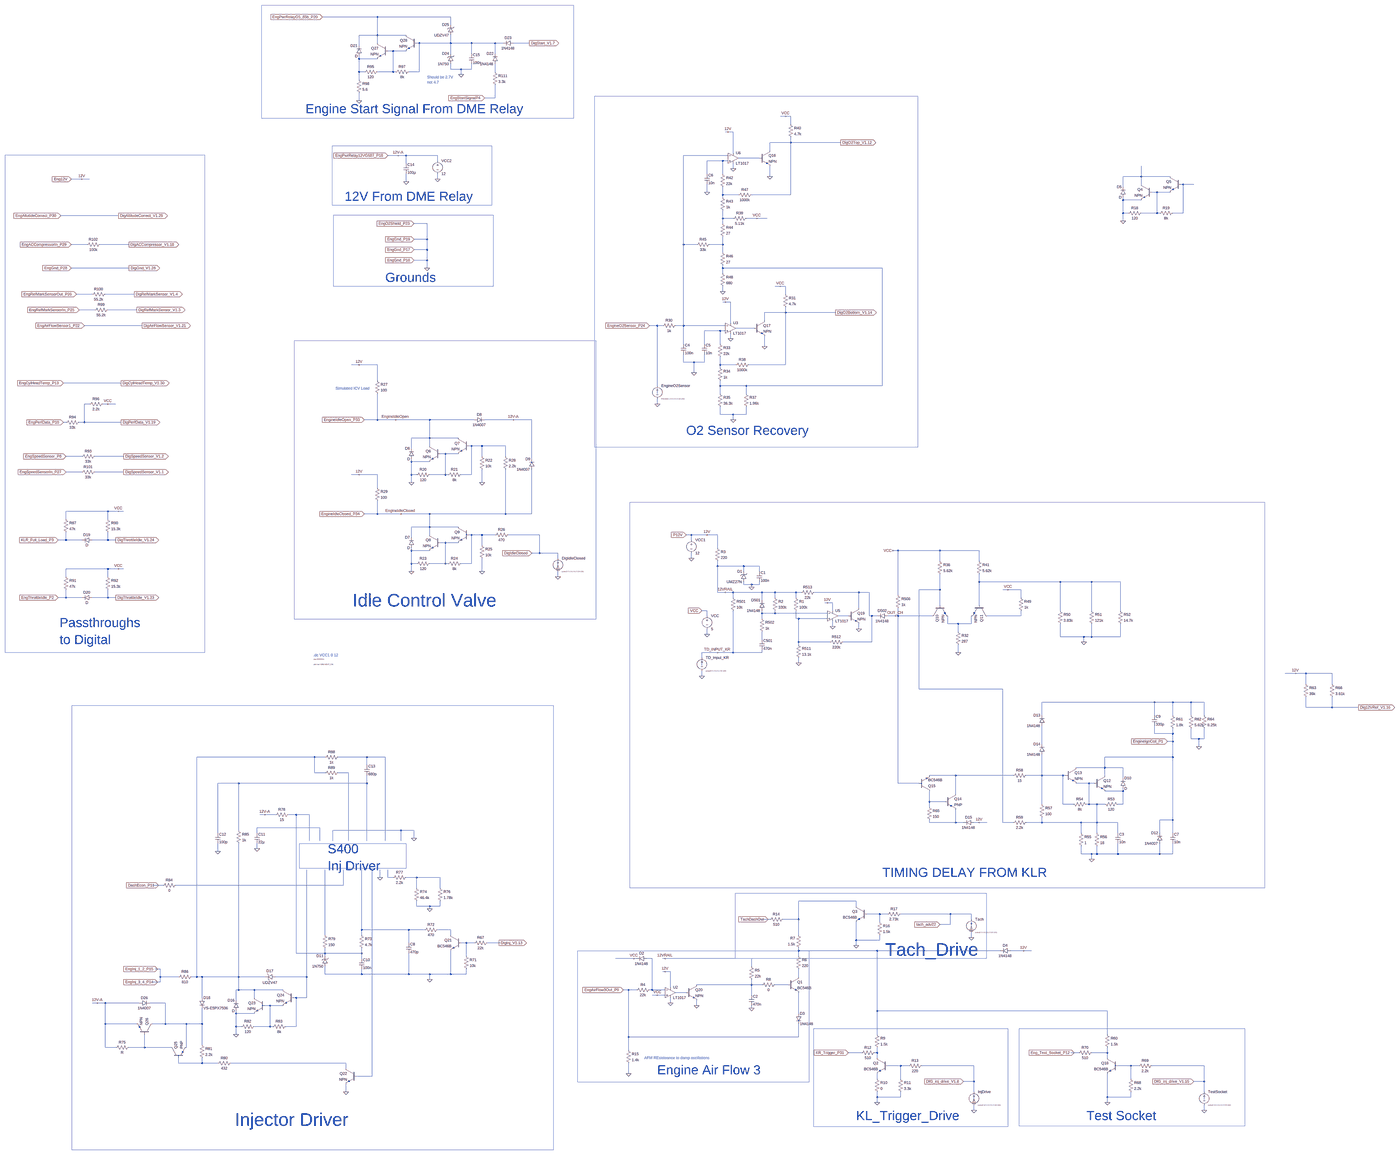
[diagram p0: schematic dme_analog_full_flat.asc, whole sheet]
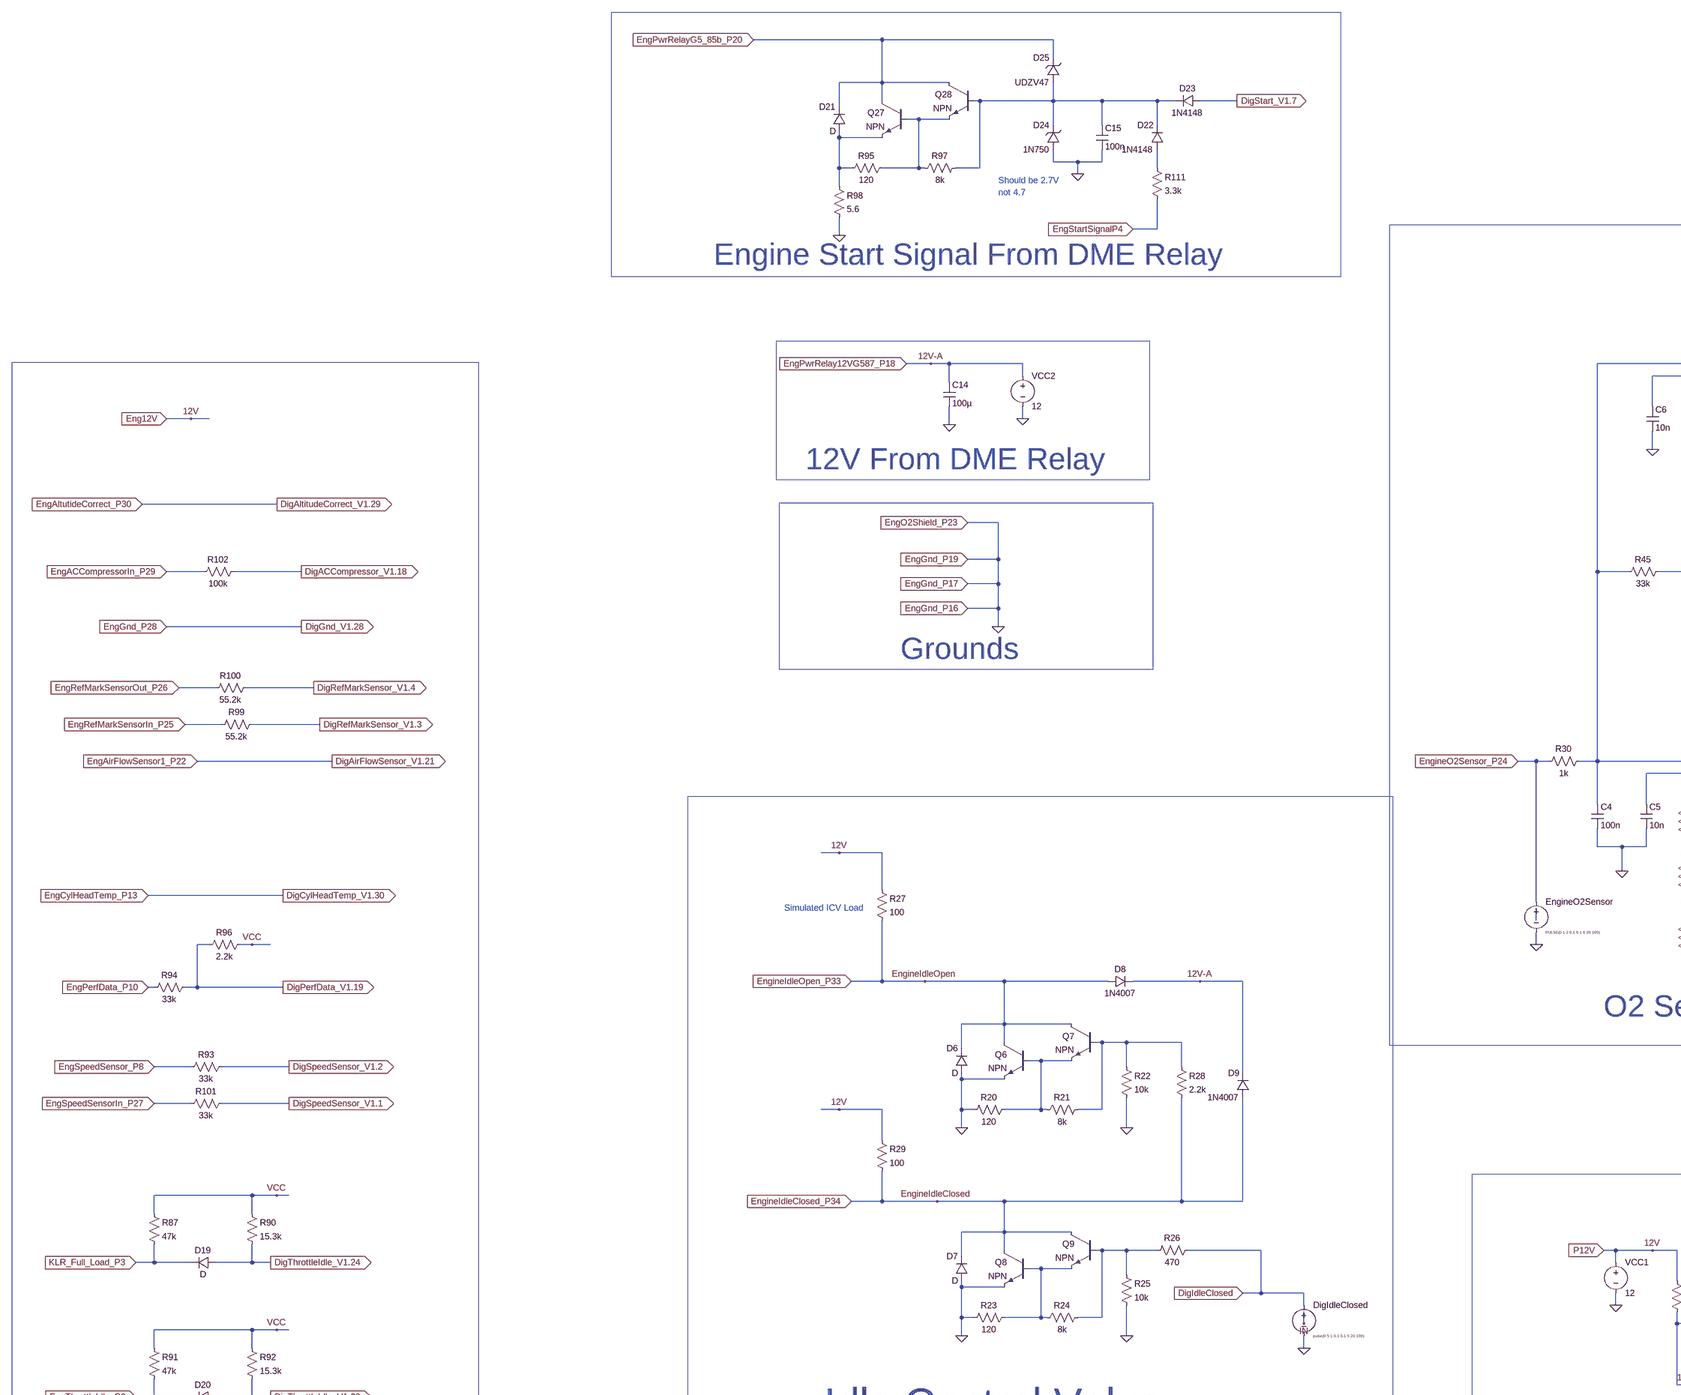
[diagram p1: schematic dme_analog_full_flat.asc, part, row 1 of 2, column 1 of 2]
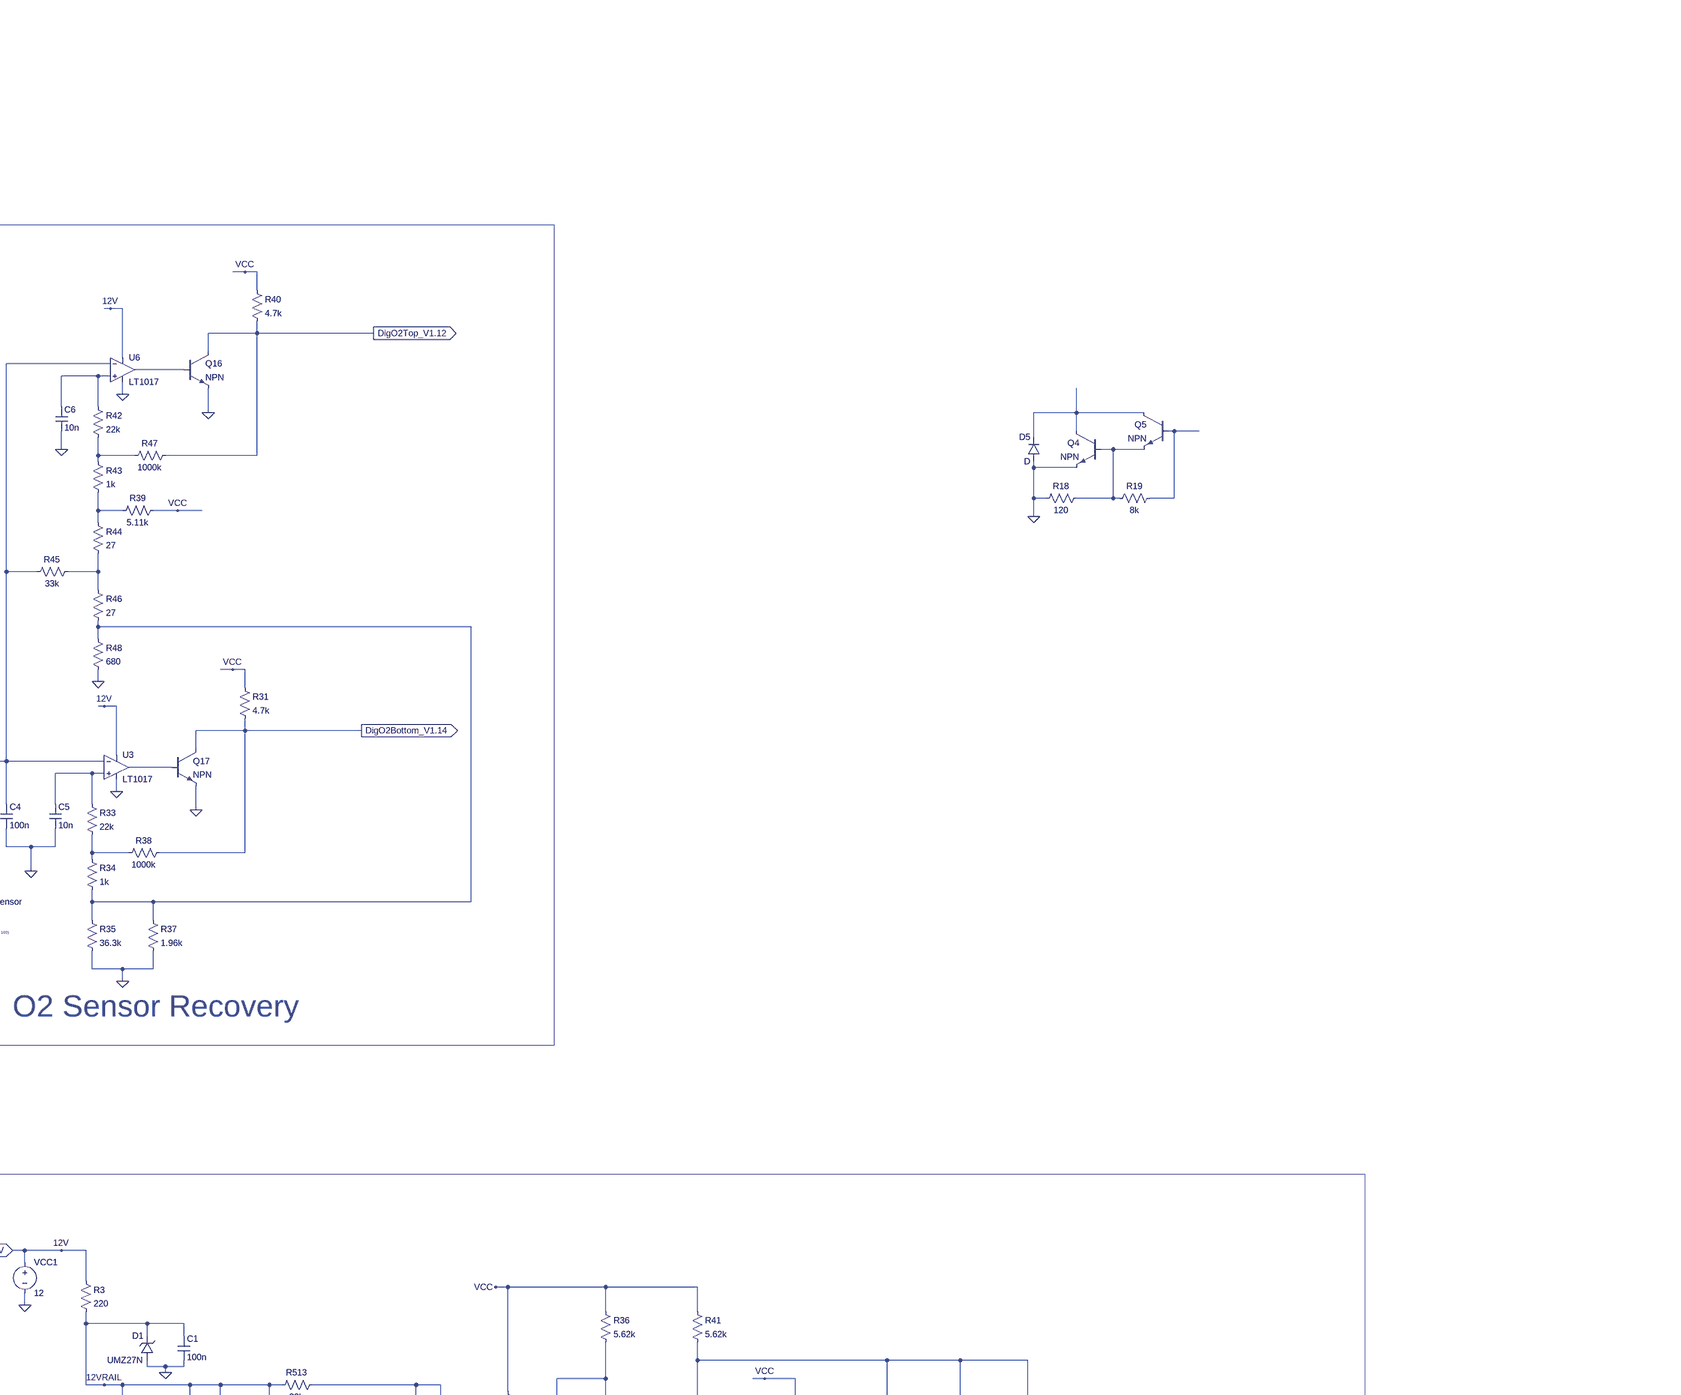
[diagram p2: schematic dme_analog_full_flat.asc, part, row 1 of 2, column 2 of 2]
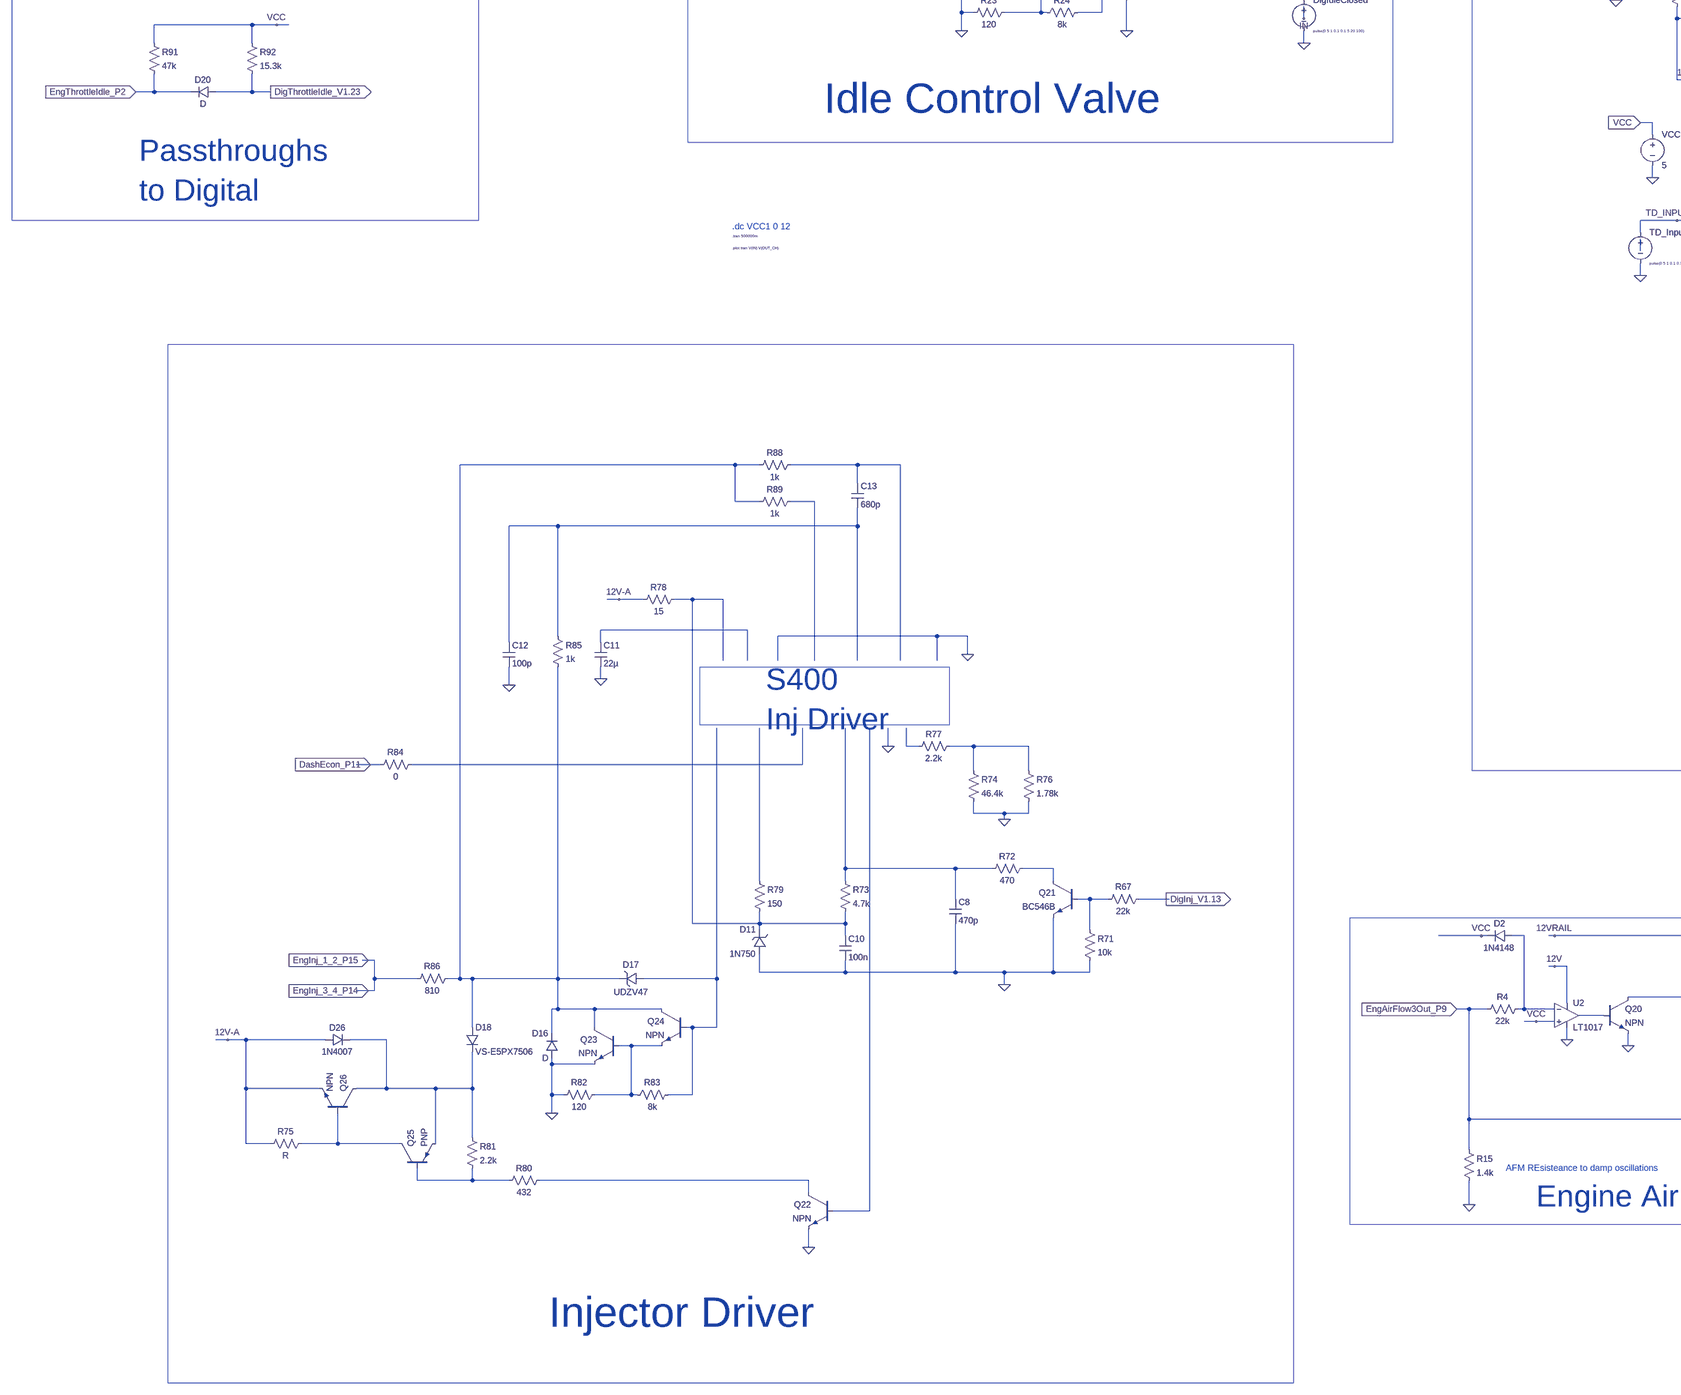
[diagram p3: schematic dme_analog_full_flat.asc, part, row 2 of 2, column 1 of 2]
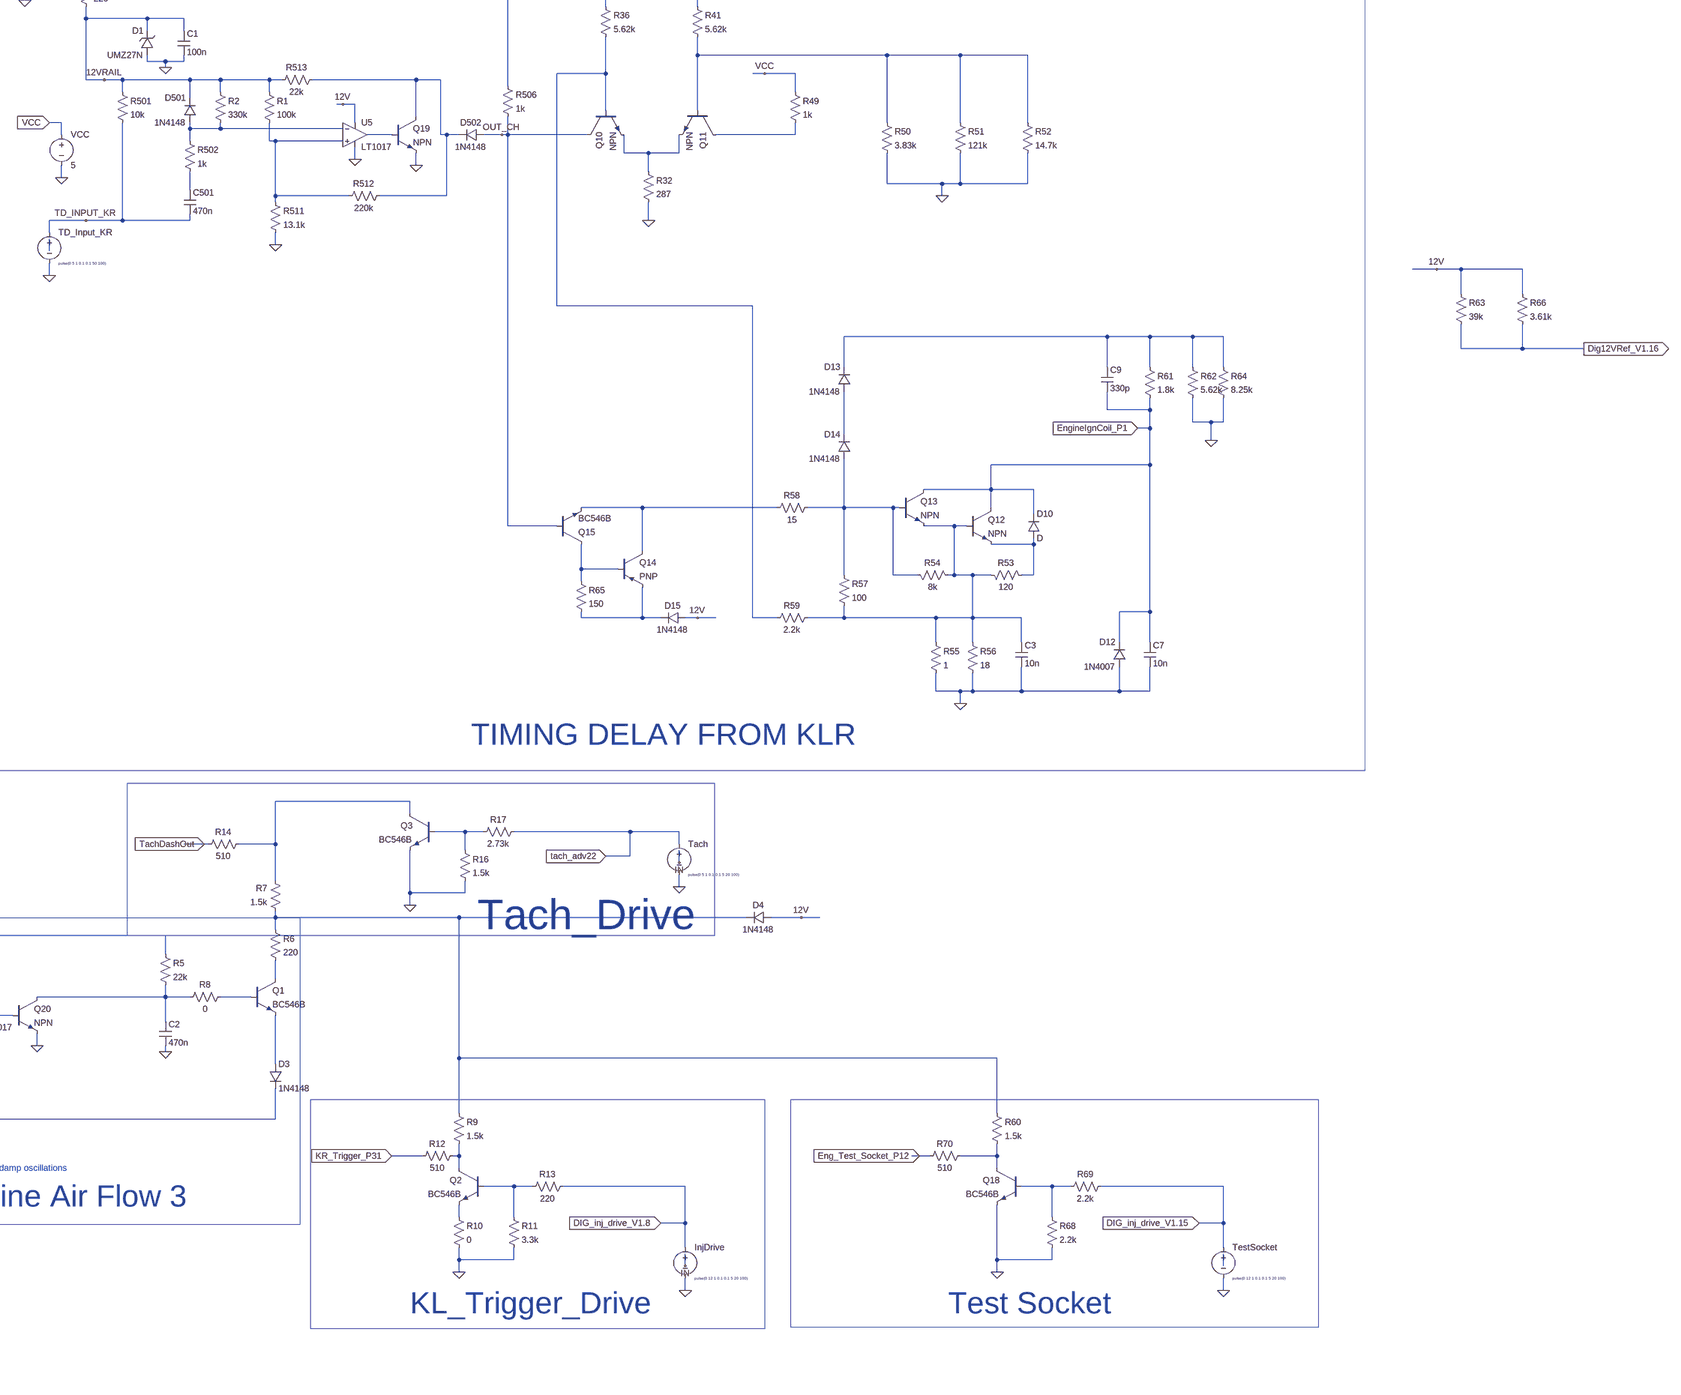
[diagram p4: schematic dme_analog_full_flat.asc, part, row 2 of 2, column 2 of 2]
dme_analog_full_flat.asc, the LTspice schematic file:
Version 4
SHEET 1 4356 3824
WIRE -2304 -3440 -2640 -3440
WIRE -1856 -3440 -2304 -3440
WIRE -1856 -3392 -1856 -3440
WIRE -2304 -3328 -2304 -3440
WIRE -2304 -3328 -2416 -3328
WIRE -2128 -3328 -2304 -3328
WIRE -2304 -3280 -2304 -3328
WIRE -2048 -3280 -2064 -3280
WIRE -1856 -3280 -1856 -3328
WIRE -1856 -3280 -2048 -3280
WIRE -1728 -3280 -1856 -3280
WIRE -1584 -3280 -1728 -3280
WIRE -1536 -3280 -1584 -3280
WIRE -1376 -3280 -1472 -3280
WIRE -2416 -3264 -2416 -3328
WIRE -2208 -3232 -2240 -3232
WIRE -2128 -3232 -2208 -3232
WIRE -1856 -3216 -1856 -3280
WIRE -1728 -3216 -1728 -3280
WIRE -1584 -3216 -1584 -3280
WIRE -2416 -3184 -2416 -3200
WIRE -2304 -3184 -2416 -3184
WIRE -1856 -3120 -1856 -3152
WIRE -1792 -3120 -1856 -3120
WIRE -1728 -3120 -1728 -3152
WIRE -1728 -3120 -1792 -3120
WIRE -2416 -3104 -2416 -3184
WIRE -2384 -3104 -2416 -3104
WIRE -2208 -3104 -2208 -3232
WIRE -2208 -3104 -2304 -3104
WIRE -2192 -3104 -2208 -3104
WIRE -2048 -3104 -2048 -3280
WIRE -2048 -3104 -2112 -3104
WIRE -1584 -3104 -1584 -3152
WIRE -1792 -3088 -1792 -3120
WIRE -2416 -3056 -2416 -3104
WIRE -1584 -2944 -1584 -3024
WIRE -1584 -2944 -1648 -2944
WIRE -2416 -2928 -2416 -2976
WIRE 192 -2832 160 -2832
WIRE 224 -2832 192 -2832
WIRE 224 -2784 224 -2832
WIRE -160 -2736 -176 -2736
WIRE -128 -2736 -160 -2736
WIRE 224 -2672 224 -2704
WIRE 224 -2672 96 -2672
WIRE 528 -2672 224 -2672
WIRE 96 -2624 96 -2672
WIRE -128 -2608 -128 -2736
WIRE -2176 -2592 -2240 -2592
WIRE -2128 -2592 -2176 -2592
WIRE -1936 -2592 -2128 -2592
WIRE -160 -2592 -432 -2592
WIRE 32 -2576 -96 -2576
WIRE -1936 -2560 -1936 -2592
WIRE -192 -2560 -288 -2560
WIRE -160 -2560 -192 -2560
WIRE -2128 -2544 -2128 -2592
WIRE -128 -2512 -128 -2544
WIRE -288 -2480 -288 -2560
WIRE -192 -2480 -192 -2560
WIRE 96 -2464 96 -2528
WIRE 2368 -2464 2368 -2528
WIRE 2368 -2464 2256 -2464
WIRE 2544 -2464 2368 -2464
WIRE -4112 -2448 -4176 -2448
WIRE -4064 -2448 -4112 -2448
WIRE -1936 -2448 -1936 -2480
WIRE -2128 -2432 -2128 -2480
WIRE 2368 -2416 2368 -2464
WIRE 2624 -2416 2608 -2416
WIRE 2688 -2416 2624 -2416
WIRE 2256 -2400 2256 -2464
WIRE -288 -2368 -288 -2416
WIRE 2464 -2368 2432 -2368
WIRE 2544 -2368 2464 -2368
WIRE -192 -2352 -192 -2400
WIRE -96 -2352 -192 -2352
WIRE 224 -2352 224 -2672
WIRE 224 -2352 -16 -2352
WIRE -192 -2336 -192 -2352
WIRE 2256 -2320 2256 -2336
WIRE 2368 -2320 2256 -2320
WIRE 2256 -2240 2256 -2320
WIRE 2288 -2240 2256 -2240
WIRE 2464 -2240 2464 -2368
WIRE 2464 -2240 2368 -2240
WIRE 2480 -2240 2464 -2240
WIRE 2624 -2240 2624 -2416
WIRE 2624 -2240 2560 -2240
WIRE -3888 -2224 -4240 -2224
WIRE -192 -2208 -192 -2256
WIRE -128 -2208 -192 -2208
WIRE 16 -2208 -48 -2208
WIRE 80 -2208 16 -2208
WIRE 2256 -2192 2256 -2240
WIRE -2000 -2176 -2080 -2176
WIRE -192 -2176 -192 -2208
WIRE -2000 -2080 -2000 -2176
WIRE -2000 -2080 -2080 -2080
WIRE -4080 -2048 -4176 -2048
WIRE -3824 -2048 -4000 -2048
WIRE -432 -2048 -432 -2592
WIRE -352 -2048 -432 -2048
WIRE -192 -2048 -192 -2096
WIRE -192 -2048 -272 -2048
WIRE -2000 -2016 -2000 -2080
WIRE -2000 -2016 -2080 -2016
WIRE -192 -2000 -192 -2048
WIRE -2000 -1952 -2000 -2016
WIRE -2000 -1952 -2080 -1952
WIRE -3824 -1904 -4176 -1904
WIRE -2000 -1904 -2000 -1952
WIRE -192 -1904 -192 -1920
WIRE 784 -1904 -192 -1904
WIRE -192 -1872 -192 -1904
WIRE 160 -1792 128 -1792
WIRE 192 -1792 160 -1792
WIRE -192 -1760 -192 -1792
WIRE -4048 -1744 -4144 -1744
WIRE -3792 -1744 -3968 -1744
WIRE 192 -1744 192 -1792
WIRE -176 -1696 -192 -1696
WIRE -144 -1696 -176 -1696
WIRE -4032 -1648 -4128 -1648
WIRE -3776 -1648 -3952 -1648
WIRE 192 -1632 192 -1664
WIRE 192 -1632 64 -1632
WIRE 496 -1632 192 -1632
WIRE 64 -1584 64 -1632
WIRE -144 -1568 -144 -1696
WIRE -3744 -1552 -4096 -1552
WIRE -592 -1552 -640 -1552
WIRE -560 -1552 -592 -1552
WIRE -432 -1552 -432 -2048
WIRE -432 -1552 -480 -1552
WIRE -176 -1552 -432 -1552
WIRE 0 -1536 -112 -1536
WIRE -208 -1520 -304 -1520
WIRE -176 -1520 -208 -1520
WIRE -144 -1472 -144 -1504
WIRE -432 -1440 -432 -1552
WIRE -304 -1440 -304 -1520
WIRE -208 -1440 -208 -1520
WIRE 64 -1424 64 -1488
WIRE -432 -1328 -432 -1376
WIRE -368 -1328 -432 -1328
WIRE -304 -1328 -304 -1376
WIRE -304 -1328 -368 -1328
WIRE -2416 -1312 -2464 -1312
WIRE -2304 -1312 -2416 -1312
WIRE -208 -1312 -208 -1360
WIRE -112 -1312 -208 -1312
WIRE 192 -1312 192 -1632
WIRE 192 -1312 -32 -1312
WIRE -208 -1296 -208 -1312
WIRE -368 -1264 -368 -1328
WIRE -2304 -1216 -2304 -1312
WIRE -3872 -1200 -4224 -1200
WIRE -592 -1184 -592 -1552
WIRE -208 -1184 -208 -1216
WIRE -48 -1184 -208 -1184
WIRE 784 -1184 784 -1904
WIRE 784 -1184 -48 -1184
WIRE -592 -1136 -592 -1168
WIRE -208 -1136 -208 -1184
WIRE -48 -1136 -48 -1184
WIRE -4064 -1072 -4096 -1072
WIRE -3952 -1072 -3984 -1072
WIRE -3904 -1072 -3952 -1072
WIRE -592 -1072 -592 -1104
WIRE -208 -1008 -208 -1056
WIRE -128 -1008 -208 -1008
WIRE -48 -1008 -48 -1056
WIRE -48 -1008 -128 -1008
WIRE -2304 -976 -2304 -1136
WIRE -2304 -976 -2384 -976
WIRE -2192 -976 -2304 -976
WIRE -1984 -976 -2192 -976
WIRE -1712 -976 -1984 -976
WIRE -1472 -976 -1648 -976
WIRE -1360 -976 -1472 -976
WIRE -128 -976 -128 -1008
WIRE -4208 -960 -4224 -960
WIRE -4096 -960 -4096 -1072
WIRE -4096 -960 -4128 -960
WIRE -3872 -960 -4096 -960
WIRE -1984 -864 -1984 -976
WIRE -1984 -864 -2096 -864
WIRE -1808 -864 -1984 -864
WIRE -1984 -816 -1984 -864
WIRE -1728 -816 -1744 -816
WIRE -1664 -816 -1728 -816
WIRE -1520 -816 -1664 -816
WIRE -2096 -800 -2096 -864
WIRE -1888 -768 -1920 -768
WIRE -1808 -768 -1888 -768
WIRE -4112 -752 -4208 -752
WIRE -3856 -752 -4032 -752
WIRE -1664 -752 -1664 -816
WIRE -1520 -752 -1520 -816
WIRE -1360 -736 -1360 -976
WIRE -2096 -720 -2096 -736
WIRE -1984 -720 -2096 -720
WIRE -4112 -656 -4208 -656
WIRE -3856 -656 -4032 -656
WIRE -2416 -640 -2464 -640
WIRE -2304 -640 -2416 -640
WIRE -2096 -640 -2096 -720
WIRE -2064 -640 -2096 -640
WIRE -1888 -640 -1888 -768
WIRE -1888 -640 -1984 -640
WIRE -1872 -640 -1888 -640
WIRE -1728 -640 -1728 -816
WIRE -1728 -640 -1792 -640
WIRE -2096 -592 -2096 -640
WIRE -1664 -592 -1664 -672
WIRE -2304 -560 -2304 -640
WIRE -3952 -416 -4208 -416
WIRE -3888 -416 -3952 -416
WIRE -3856 -416 -3888 -416
WIRE -2304 -400 -2304 -480
WIRE -2304 -400 -2384 -400
WIRE -2160 -400 -2304 -400
WIRE -1984 -400 -2160 -400
WIRE -1520 -400 -1520 -672
WIRE -1520 -400 -1984 -400
WIRE -1360 -400 -1360 -672
WIRE -1360 -400 -1520 -400
WIRE -4208 -368 -4208 -416
WIRE -3952 -368 -3952 -416
WIRE -1984 -320 -1984 -400
WIRE -1984 -320 -2096 -320
WIRE -1808 -320 -1984 -320
WIRE -1984 -272 -1984 -320
WIRE -1728 -272 -1744 -272
WIRE -1664 -272 -1728 -272
WIRE -1584 -272 -1664 -272
WIRE -1312 -272 -1504 -272
WIRE -384 -272 -416 -272
WIRE -288 -272 -384 -272
WIRE -224 -272 -288 -272
WIRE -2096 -256 -2096 -320
WIRE -4208 -240 -4208 -288
WIRE -4208 -240 -4256 -240
WIRE -4112 -240 -4208 -240
WIRE -3952 -240 -3952 -288
WIRE -3952 -240 -4048 -240
WIRE -3904 -240 -3952 -240
WIRE -384 -240 -384 -272
WIRE -1888 -224 -1920 -224
WIRE -1808 -224 -1888 -224
WIRE -1664 -208 -1664 -272
WIRE -224 -192 -224 -272
WIRE -2096 -176 -2096 -192
WIRE -1984 -176 -2096 -176
WIRE 880 -176 848 -176
WIRE 1136 -176 880 -176
WIRE 1376 -176 1136 -176
WIRE -1312 -160 -1312 -272
WIRE -1312 -160 -1360 -160
WIRE -1200 -160 -1312 -160
WIRE -1200 -128 -1200 -160
WIRE -384 -128 -384 -160
WIRE 1136 -112 1136 -176
WIRE 1376 -112 1376 -176
WIRE -2096 -96 -2096 -176
WIRE -2064 -96 -2096 -96
WIRE -1888 -96 -1888 -224
WIRE -1888 -96 -1984 -96
WIRE -1872 -96 -1888 -96
WIRE -1728 -96 -1728 -272
WIRE -1728 -96 -1792 -96
WIRE -1200 -80 -1200 -112
WIRE -224 -80 -224 -112
WIRE -64 -80 -224 -80
WIRE 32 -80 -64 -80
WIRE -3952 -64 -4208 -64
WIRE -3888 -64 -3952 -64
WIRE -3856 -64 -3888 -64
WIRE -2096 -48 -2096 -96
WIRE -1664 -48 -1664 -128
WIRE -64 -48 -64 -80
WIRE 32 -48 32 -80
WIRE -4208 -16 -4208 -64
WIRE -3952 -16 -3952 -64
WIRE -1200 -16 -1200 -48
WIRE 1376 16 1376 -32
WIRE 1872 16 1376 16
WIRE 2064 16 1872 16
WIRE 2240 16 2064 16
WIRE -64 32 -64 16
WIRE -16 32 -64 32
WIRE 32 32 32 16
WIRE 32 32 -16 32
WIRE -16 48 -16 32
WIRE 1136 64 1136 -32
WIRE 1136 64 1008 64
WIRE 1552 64 1520 64
WIRE 1632 64 1552 64
WIRE -224 80 -224 -80
WIRE -176 80 -224 80
WIRE -128 80 -176 80
WIRE 48 80 -128 80
WIRE 128 80 48 80
WIRE 256 80 128 80
WIRE 288 80 256 80
WIRE 640 80 368 80
WIRE 704 80 640 80
WIRE 880 96 880 -176
WIRE -4208 112 -4208 64
WIRE -4208 112 -4256 112
WIRE -4112 112 -4208 112
WIRE -3952 112 -3952 64
WIRE -3952 112 -4048 112
WIRE -3904 112 -3952 112
WIRE -128 112 -128 80
WIRE 128 112 128 80
WIRE 256 112 256 80
WIRE 1632 112 1632 64
WIRE 48 128 48 80
WIRE 448 144 432 144
WIRE 480 144 448 144
WIRE 1136 160 1136 64
WIRE 1376 160 1376 16
WIRE 640 176 640 80
WIRE -288 192 -320 192
WIRE 480 192 480 144
WIRE 1872 192 1872 16
WIRE 2064 192 2064 16
WIRE 2240 192 2240 16
WIRE 48 208 48 192
WIRE 128 208 128 192
WIRE 128 208 48 208
WIRE 448 208 128 208
WIRE -288 224 -288 192
WIRE 576 224 512 224
WIRE 704 224 704 80
WIRE 720 224 704 224
WIRE 752 224 720 224
WIRE 864 224 816 224
WIRE 880 224 880 176
WIRE 880 224 864 224
WIRE 1088 224 880 224
WIRE 1632 224 1632 192
WIRE 1632 224 1424 224
WIRE 48 240 48 208
WIRE 256 240 256 192
WIRE 272 240 256 240
WIRE 448 240 272 240
WIRE 1184 272 1184 224
WIRE 1248 272 1184 272
WIRE 1328 272 1328 224
WIRE 1328 272 1248 272
WIRE 480 288 480 256
WIRE 640 304 640 272
WIRE 1248 320 1248 272
WIRE -288 336 -288 304
WIRE 1872 352 1872 272
WIRE 2016 352 1872 352
WIRE 2064 352 2064 272
WIRE 2064 352 2016 352
WIRE 2240 352 2240 272
WIRE 2240 352 2064 352
WIRE 48 368 48 320
WIRE 272 384 272 240
WIRE 464 384 272 384
WIRE 720 384 720 224
WIRE 720 384 544 384
WIRE 2016 384 2016 352
WIRE 272 400 272 384
WIRE -224 448 -320 448
WIRE -128 448 -128 192
WIRE -128 448 -224 448
WIRE 48 448 48 432
WIRE 48 448 -128 448
WIRE 1248 448 1248 400
WIRE -320 480 -320 448
WIRE 272 512 272 480
WIRE -320 528 -320 496
WIRE 3328 576 3264 576
WIRE 3392 576 3328 576
WIRE 3552 576 3392 576
WIRE -320 592 -320 560
WIRE 3392 640 3392 576
WIRE 3552 640 3552 576
WIRE 1008 672 1008 64
WIRE 1520 672 1008 672
WIRE 2448 752 1760 752
WIRE 2560 752 2448 752
WIRE 2672 752 2560 752
WIRE 2752 752 2672 752
WIRE 3392 784 3392 720
WIRE 3552 784 3552 720
WIRE 3552 784 3392 784
WIRE 3712 784 3552 784
WIRE 1760 832 1760 752
WIRE 2448 832 2448 752
WIRE 2560 832 2560 752
WIRE 2672 832 2672 752
WIRE 2752 832 2752 752
WIRE 2448 944 2448 896
WIRE 2560 944 2560 912
WIRE 2560 944 2448 944
WIRE 2672 976 2672 912
WIRE 2720 976 2672 976
WIRE 2752 976 2752 912
WIRE 2752 976 2720 976
WIRE 2560 992 2560 944
WIRE 2560 992 2528 992
WIRE 1760 1008 1760 896
WIRE 2720 1024 2720 976
WIRE -2688 1088 -3408 1088
WIRE -2624 1088 -2688 1088
WIRE -2368 1088 -2544 1088
WIRE -2256 1088 -2368 1088
WIRE 2560 1088 2560 992
WIRE 2560 1088 2144 1088
WIRE -2368 1136 -2368 1088
WIRE 2144 1152 2144 1088
WIRE 2144 1152 1968 1152
WIRE 2256 1152 2144 1152
WIRE -2688 1184 -2688 1088
WIRE -2624 1184 -2688 1184
WIRE -2480 1184 -2544 1184
WIRE 1232 1200 1072 1200
WIRE 1584 1200 1232 1200
WIRE 1760 1200 1760 1072
WIRE 1760 1200 1664 1200
WIRE 1888 1200 1760 1200
WIRE 1904 1200 1888 1200
WIRE 2144 1200 2144 1152
WIRE 2256 1216 2256 1152
WIRE -3152 1248 -3280 1248
WIRE -2368 1248 -2368 1200
WIRE -2368 1248 -3152 1248
WIRE 880 1248 880 224
WIRE 1008 1248 880 1248
WIRE 2048 1248 1968 1248
WIRE 2080 1248 2048 1248
WIRE 2256 1296 2256 1280
WIRE 2256 1296 2144 1296
WIRE 1232 1312 1232 1200
WIRE 1072 1360 1072 1296
WIRE 1168 1360 1072 1360
WIRE 1760 1376 1760 1200
WIRE 1888 1376 1888 1200
WIRE 1952 1376 1888 1376
WIRE 2048 1376 2048 1248
WIRE 2048 1376 2032 1376
WIRE 2096 1376 2048 1376
WIRE 2144 1376 2096 1376
WIRE 2256 1376 2256 1296
WIRE 2256 1376 2224 1376
WIRE 1072 1392 1072 1360
WIRE -2992 1440 -3024 1440
WIRE -2928 1440 -2992 1440
WIRE -2800 1440 -2848 1440
WIRE -2720 1440 -2800 1440
WIRE 2560 1472 2560 1088
WIRE 2560 1472 2480 1472
WIRE 1072 1488 1072 1472
WIRE 1232 1488 1232 1408
WIRE 1232 1488 1072 1488
WIRE 1280 1488 1232 1488
WIRE 1376 1488 1344 1488
WIRE 1424 1488 1376 1488
WIRE 1520 1488 1520 672
WIRE 1584 1488 1520 1488
WIRE 1760 1488 1760 1456
WIRE 1760 1488 1664 1488
WIRE 2000 1488 1760 1488
WIRE 2096 1488 2096 1376
WIRE 2096 1488 2000 1488
WIRE 2224 1488 2096 1488
WIRE -2656 1520 -3040 1520
WIRE -3152 1536 -3152 1248
WIRE -2160 1536 -2576 1536
WIRE -2080 1536 -2160 1536
WIRE -3280 1552 -3280 1248
WIRE -3040 1552 -3040 1520
WIRE 2000 1552 2000 1488
WIRE 2096 1552 2096 1488
WIRE 2224 1552 2224 1488
WIRE 2480 1552 2480 1472
WIRE 2560 1552 2560 1472
WIRE -2080 1584 -2080 1536
WIRE -2720 1600 -2720 1440
WIRE -2656 1600 -2656 1520
WIRE -2576 1600 -2576 1536
WIRE -2480 1600 -2480 1184
WIRE -2368 1600 -2368 1248
WIRE -2256 1600 -2256 1088
WIRE -2160 1600 -2160 1536
WIRE -3040 1648 -3040 1616
WIRE -3280 1664 -3280 1616
WIRE 2000 1680 2000 1632
WIRE 2064 1680 2000 1680
WIRE 2096 1680 2096 1632
WIRE 2096 1680 2064 1680
WIRE 2224 1680 2224 1616
WIRE 2224 1680 2096 1680
WIRE 2480 1680 2480 1616
WIRE 2480 1680 2224 1680
WIRE 2560 1680 2560 1616
WIRE 2560 1680 2480 1680
WIRE 2064 1712 2064 1680
WIRE -2288 1824 -2288 1776
WIRE -2240 1824 -2240 1776
WIRE -2208 1824 -2240 1824
WIRE -2064 1824 -2128 1824
WIRE -1920 1824 -2064 1824
WIRE -3616 1872 -3680 1872
WIRE -2512 1872 -2512 1776
WIRE -2512 1872 -3536 1872
WIRE -2064 1888 -2064 1824
WIRE -1920 1888 -1920 1824
WIRE 624 1968 272 1968
WIRE -2064 2000 -2064 1968
WIRE -1984 2000 -2064 2000
WIRE -1920 2000 -1920 1968
WIRE -1920 2000 -1984 2000
WIRE 624 2000 624 1968
WIRE -1984 2016 -1984 2000
WIRE 768 2048 688 2048
WIRE 816 2048 768 2048
WIRE 1200 2048 896 2048
WIRE 1328 2048 1200 2048
WIRE 96 2080 32 2080
WIRE 272 2080 272 1968
WIRE 272 2080 176 2080
WIRE 1328 2080 1328 2048
WIRE 768 2096 768 2048
WIRE 1200 2112 1200 2048
WIRE 1200 2112 1136 2112
WIRE 1328 2128 1328 2096
WIRE -2400 2144 -2400 1776
WIRE -2112 2144 -2400 2144
WIRE -2016 2144 -2112 2144
WIRE -1856 2144 -1936 2144
WIRE -2624 2176 -2624 1776
WIRE -2400 2176 -2400 2144
WIRE -1856 2176 -1856 2144
WIRE 272 2176 272 2080
WIRE 1328 2192 1328 2160
WIRE 624 2208 624 2096
WIRE 768 2208 768 2176
WIRE 768 2208 624 2208
WIRE -2112 2224 -2112 2144
WIRE -1760 2224 -1792 2224
WIRE -1712 2224 -1760 2224
WIRE -1552 2224 -1632 2224
WIRE 624 2240 624 2208
WIRE 272 2272 272 2256
WIRE 752 2272 272 2272
WIRE 1504 2272 752 2272
WIRE 1648 2272 1568 2272
WIRE 1696 2272 1648 2272
WIRE -2800 2288 -2800 1440
WIRE -2624 2288 -2624 2256
WIRE -2624 2288 -2800 2288
WIRE -2400 2288 -2400 2256
WIRE -2400 2288 -2624 2288
WIRE -2624 2304 -2624 2288
WIRE -1760 2304 -1760 2224
WIRE 272 2304 272 2272
WIRE -2400 2320 -2400 2288
WIRE -736 2320 -848 2320
WIRE -720 2320 -736 2320
WIRE -624 2320 -656 2320
WIRE -544 2320 -560 2320
WIRE -16 2320 -544 2320
WIRE -16 2368 -16 2320
WIRE -3632 2384 -3664 2384
WIRE -544 2400 -560 2400
WIRE -512 2400 -544 2400
WIRE -2624 2416 -2624 2368
WIRE -2400 2416 -2400 2384
WIRE -2400 2416 -2624 2416
WIRE -2112 2416 -2112 2288
WIRE -2112 2416 -2400 2416
WIRE -1984 2416 -2112 2416
WIRE -1856 2416 -1856 2272
WIRE -1856 2416 -1984 2416
WIRE -1760 2416 -1760 2384
WIRE -1760 2416 -1856 2416
WIRE -3632 2432 -3632 2384
WIRE -3520 2432 -3632 2432
WIRE -3408 2432 -3408 1088
WIRE -3408 2432 -3440 2432
WIRE -3376 2432 -3408 2432
WIRE -3152 2432 -3152 1616
WIRE -3152 2432 -3376 2432
WIRE -2992 2432 -3152 2432
WIRE -2736 2432 -2736 1776
WIRE -2736 2432 -2928 2432
WIRE 272 2432 272 2384
WIRE -1984 2448 -1984 2416
WIRE -3632 2464 -3632 2432
WIRE -3632 2464 -3680 2464
WIRE -16 2480 -16 2448
WIRE -16 2480 -352 2480
WIRE 48 2480 -16 2480
WIRE 208 2480 128 2480
WIRE -512 2496 -512 2400
WIRE -3152 2512 -3152 2432
WIRE -3152 2512 -3168 2512
WIRE -3056 2512 -3152 2512
WIRE -2880 2512 -3056 2512
WIRE -768 2512 -800 2512
WIRE -720 2512 -768 2512
WIRE -624 2512 -624 2320
WIRE -624 2512 -640 2512
WIRE -544 2512 -624 2512
WIRE -416 2528 -480 2528
WIRE -592 2544 -624 2544
WIRE -544 2544 -592 2544
WIRE -16 2544 -16 2480
WIRE -3376 2560 -3376 2432
WIRE -3056 2560 -3056 2512
WIRE -2800 2560 -2816 2560
WIRE -2736 2560 -2736 2432
WIRE -2736 2560 -2800 2560
WIRE -3168 2576 -3168 2512
WIRE -4016 2592 -4048 2592
WIRE -3968 2592 -4016 2592
WIRE -3760 2592 -3968 2592
WIRE -3600 2592 -3696 2592
WIRE -512 2592 -512 2560
WIRE -2960 2608 -2992 2608
WIRE -2880 2608 -2960 2608
WIRE -352 2608 -352 2576
WIRE -16 2624 -16 2608
WIRE 752 2640 752 2272
WIRE 2160 2640 752 2640
WIRE -3168 2656 -3168 2640
WIRE -3056 2656 -3168 2656
WIRE 272 2656 272 2528
WIRE -3968 2720 -3968 2592
WIRE -3776 2720 -3968 2720
WIRE -3600 2720 -3600 2592
WIRE -3600 2720 -3680 2720
WIRE -3472 2720 -3600 2720
WIRE -3376 2720 -3376 2624
WIRE -3376 2720 -3472 2720
WIRE -3168 2736 -3168 2656
WIRE -3136 2736 -3168 2736
WIRE -2960 2736 -2960 2608
WIRE -2960 2736 -3056 2736
WIRE -2944 2736 -2960 2736
WIRE -2800 2736 -2800 2560
WIRE -2800 2736 -2864 2736
WIRE -3168 2784 -3168 2736
WIRE 752 2784 752 2640
WIRE 2160 2784 2160 2640
WIRE -768 2800 -768 2512
WIRE 272 2800 272 2720
WIRE 272 2800 -768 2800
WIRE -3376 2848 -3376 2720
WIRE -3968 2864 -3968 2720
WIRE -3904 2864 -3968 2864
WIRE -3728 2864 -3728 2784
WIRE -3728 2864 -3824 2864
WIRE -3568 2864 -3728 2864
WIRE -3472 2864 -3472 2720
WIRE -768 2880 -768 2800
WIRE 656 2896 576 2896
WIRE 752 2896 752 2864
WIRE 752 2896 736 2896
WIRE 1984 2896 1936 2896
WIRE 2160 2896 2160 2864
WIRE 2160 2896 2064 2896
WIRE 752 2928 752 2896
WIRE 2160 2928 2160 2896
WIRE -3520 2960 -3520 2928
WIRE -3376 2960 -3376 2928
WIRE -3376 2960 -3520 2960
WIRE -3280 2960 -3376 2960
WIRE -2496 2960 -3200 2960
WIRE 896 2976 816 2976
WIRE 944 2976 896 2976
WIRE 1344 2976 1024 2976
WIRE 2304 2976 2224 2976
WIRE 2352 2976 2304 2976
WIRE 2752 2976 2432 2976
WIRE -2496 2992 -2496 2960
WIRE -768 3024 -768 2960
WIRE -2336 3040 -2336 1776
WIRE -2336 3040 -2432 3040
WIRE 752 3056 752 3024
WIRE 896 3056 896 2976
WIRE 2304 3056 2304 2976
WIRE 1344 3072 1344 2976
WIRE 1344 3072 1280 3072
WIRE 2752 3072 2752 2976
WIRE 2752 3072 2688 3072
WIRE -2496 3136 -2496 3088
WIRE 1344 3136 1344 3072
WIRE 2752 3136 2752 3072
WIRE 752 3168 752 3136
WIRE 896 3168 896 3136
WIRE 896 3168 752 3168
WIRE 2160 3168 2160 3024
WIRE 2304 3168 2304 3136
WIRE 2304 3168 2160 3168
WIRE 1344 3184 1344 3152
WIRE 2752 3184 2752 3152
WIRE 752 3200 752 3168
WIRE 2160 3200 2160 3168
WIRE 1344 3248 1344 3216
WIRE 2752 3248 2752 3216
FLAG -320 592 0
FLAG 848 -176 VCC
FLAG 272 512 0
FLAG -288 336 0
FLAG -320 192 VCC
IOPIN -320 192 In
FLAG -384 -128 0
FLAG -416 -272 P12V
IOPIN -416 -272 In
FLAG -176 80 12VRAIL
FLAG 864 224 OUT_CH
FLAG -224 448 TD_INPUT_KR
FLAG -16 48 0
FLAG -544 2320 12VRAIL
FLAG -592 2544 VCC
FLAG -800 2512 EngAirFlow3Out_P9
IOPIN -800 2512 In
FLAG -736 2320 VCC
FLAG -16 2624 0
FLAG -288 -272 12V
FLAG 1648 2272 12V
FLAG 752 3200 0
FLAG 1280 3072 DIG_inj_drive_V1.8
IOPIN 1280 3072 In
FLAG 576 2896 KR_Trigger_P31
IOPIN 576 2896 In
FLAG 624 2240 0
FLAG 1136 2112 tach_adv22
IOPIN 1136 2112 In
FLAG -96 2080 TachDashOut
IOPIN -96 2080 Out
FLAG 1344 3248 0
FLAG 1344 3184 IN
FLAG 1328 2192 0
FLAG 1328 2128 IN
FLAG -768 3024 0
FLAG -2384 -976 EngineIdleOpen_P33
IOPIN -2384 -976 In
FLAG -1664 -592 0
FLAG -1664 -48 0
FLAG -1360 -160 DigIdleClosed
IOPIN -1360 -160 In
FLAG -2384 -400 EngineIdleClosed_P34
IOPIN -2384 -400 In
FLAG -1472 -976 12V-A
FLAG -1200 -16 0
FLAG -1200 -80 IN
FLAG -2160 -400 EngineIdleClosed
FLAG -2192 -976 EngineIdleOpen
FLAG -2416 -640 12V
FLAG -2416 -1312 12V
FLAG -176 -1696 12V
FLAG -144 -1472 0
FLAG -640 -1552 EngineO2Sensor_P24
IOPIN -640 -1552 In
FLAG -368 -1264 0
FLAG 160 -1792 VCC
FLAG -128 -976 0
FLAG 496 -1632 DigO2Bottom_V1.14
IOPIN 496 -1632 Out
FLAG -160 -2736 12V
FLAG -128 -2512 0
FLAG 192 -2832 VCC
FLAG 528 -2672 DigO2Top_V1.12
IOPIN 528 -2672 Out
FLAG -288 -2368 0
FLAG 16 -2208 VCC
FLAG -192 -1760 0
FLAG -592 -1072 0
FLAG 2016 384 0
FLAG 1552 64 VCC
FLAG 1248 448 0
FLAG 2064 1712 0
FLAG 2528 992 EngineIgnCoil_P1
IOPIN 2528 992 In
FLAG 2720 1024 0
FLAG 1376 1488 12V
FLAG 96 -2464 0
FLAG 64 -1424 0
FLAG 448 144 12V
FLAG 480 288 0
FLAG 640 304 0
FLAG -544 2400 12V
FLAG -512 2592 0
FLAG -352 2608 0
FLAG 3328 576 12V
FLAG 3712 784 Dig12VRef_V1.16
IOPIN 3712 784 Out
FLAG 2160 3200 0
FLAG 2688 3072 DIG_inj_drive_V1.15
IOPIN 2688 3072 In
FLAG 1680 2896 Eng_Test_Socket_P12
IOPIN 1680 2896 Out
FLAG 2752 3248 0
FLAG -1392 2224 DigInj_V1.13
IOPIN -1392 2224 In
FLAG -1984 2448 0
FLAG -2288 1824 0
FLAG -1984 2016 0
FLAG -2992 1440 12V-A
FLAG -2496 3136 0
FLAG -3168 2784 0
FLAG -2096 -48 0
FLAG -2096 -592 0
FLAG 2256 -2192 0
FLAG -3040 1648 0
FLAG -2080 1584 0
FLAG -3280 1664 0
FLAG -3840 1872 DashEcon_P11
IOPIN -3840 1872 Out
FLAG -3856 2384 EngInj_1_2_P15
IOPIN -3856 2384 Out
FLAG -3856 2464 EngInj_3_4_P14
IOPIN -3856 2464 Out
FLAG -3888 -416 VCC
FLAG -4256 -240 KLR_Full_Load_P3
IOPIN -4256 -240 In
FLAG -3904 -240 DigThrottleIdle_V1.24
IOPIN -3904 -240 Out
FLAG -3888 -64 VCC
FLAG -4256 112 EngThrottleIdle_P2
IOPIN -4256 112 In
FLAG -3904 112 DigThrottleIdle_V1.23
IOPIN -3904 112 Out
FLAG -4208 -752 EngSpeedSensor_P8
IOPIN -4208 -752 In
FLAG -3856 -752 DigSpeedSensor_V1.2
IOPIN -3856 -752 Out
FLAG -4224 -960 EngPerfData_P10
IOPIN -4224 -960 In
FLAG -3872 -960 DigPerfData_V1.19
IOPIN -3872 -960 Out
FLAG -3952 -1072 VCC
FLAG -4224 -1200 EngCylHeadTemp_P13
IOPIN -4224 -1200 In
FLAG -3872 -1200 DigCylHeadTemp_V1.30
IOPIN -3872 -1200 Out
FLAG -2080 -1952 EngGnd_P16
IOPIN -2080 -1952 In
FLAG -2080 -2016 EngGnd_P17
IOPIN -2080 -2016 In
FLAG -2080 -2080 EngGnd_P19
IOPIN -2080 -2080 In
FLAG -2080 -2176 EngO2Shield_P23
IOPIN -2080 -2176 In
FLAG -2000 -1904 0
FLAG -2240 -2592 EngPwrRelay12VG587_P18
IOPIN -2240 -2592 In
FLAG -2176 -2592 12V-A
FLAG -2128 -2432 0
FLAG -2416 -2928 0
FLAG -2640 -3440 EngPwrRelayG5_85b_P20
IOPIN -2640 -3440 In
FLAG -1792 -3088 0
FLAG -1648 -2944 EngStartSignalP4
IOPIN -1648 -2944 In
FLAG -1376 -3280 DigStart_V1.7
IOPIN -1376 -3280 Out
FLAG -4096 -1552 EngAirFlowSensor1_P22
IOPIN -4096 -1552 In
FLAG -3744 -1552 DigAirFlowSensor_V1.21
IOPIN -3744 -1552 Out
FLAG -4128 -1648 EngRefMarkSensorIn_P25
IOPIN -4128 -1648 In
FLAG -3776 -1648 DigRefMarkSensor_V1.3
IOPIN -3776 -1648 Out
FLAG -4144 -1744 EngRefMarkSensorOut_P26
IOPIN -4144 -1744 In
FLAG -3792 -1744 DigRefMarkSensor_V1.4
IOPIN -3792 -1744 Out
FLAG -4208 -656 EngSpeedSensorIn_P27
IOPIN -4208 -656 In
FLAG -3856 -656 DigSpeedSensor_V1.1
IOPIN -3856 -656 Out
FLAG -4176 -1904 EngGnd_P28
IOPIN -4176 -1904 In
FLAG -3824 -1904 DigGnd_V1.28
IOPIN -3824 -1904 Out
FLAG -4176 -2048 EngACCompressorIn_P29
IOPIN -4176 -2048 In
FLAG -3824 -2048 DigACCompressor_V1.18
IOPIN -3824 -2048 Out
FLAG -4240 -2224 EngAltutideCorrect_P30
IOPIN -4240 -2224 In
FLAG -3888 -2224 DigAltitudeCorrect_V1.29
IOPIN -3888 -2224 Out
FLAG -4176 -2448 Eng12V
IOPIN -4176 -2448 In
FLAG -4112 -2448 12V
FLAG -1936 -2448 0
FLAG -4016 2592 12V-A
SYMBOL voltage -320 464 R0
WINDOW 3 24 96 Left 0
SYMATTR Value pulse(0 5 1 0.1 0.1 50 100)
SYMATTR InstName TD_Input_KR
SYMBOL res -144 96 R0
SYMATTR InstName R501
SYMATTR Value 10k
SYMBOL res 32 224 R0
SYMATTR InstName R502
SYMATTR Value 1k
SYMBOL cap 32 368 R0
SYMATTR InstName C501
SYMATTR Value 470n
SYMBOL diode 64 192 R180
WINDOW 0 24 64 Left 2
WINDOW 3 24 0 Left 2
SYMATTR InstName D501
SYMATTR Value 1N4148
SYMBOL res 384 64 R90
WINDOW 0 0 56 VBottom 2
WINDOW 3 32 56 VTop 2
SYMATTR InstName R513
SYMATTR Value 22k
SYMBOL res 560 368 R90
WINDOW 0 0 56 VBottom 2
WINDOW 3 32 56 VTop 2
SYMATTR InstName R512
SYMATTR Value 220k
SYMBOL res 256 384 R0
SYMATTR InstName R511
SYMATTR Value 13.1k
SYMBOL diode 816 208 R90
WINDOW 0 0 32 VBottom 2
WINDOW 3 32 32 VTop 2
SYMATTR InstName D502
SYMATTR Value 1N4148
SYMBOL res 864 80 R0
SYMATTR InstName R506
SYMATTR Value 1k
SYMBOL voltage -288 208 R0
SYMATTR InstName VCC
SYMATTR Value 5
SYMBOL Res 240 96 R0
SYMATTR InstName R1
SYMATTR Value 100k
SYMBOL Res 112 96 R0
SYMATTR InstName R2
SYMATTR Value 330k
SYMBOL voltage -384 -256 R0
SYMATTR InstName VCC1
SYMATTR Value 12
SYMBOL Res -240 -208 R0
SYMATTR InstName R3
SYMATTR Value 220
SYMBOL zener -48 16 R180
WINDOW 0 24 64 Left 2
WINDOW 3 24 0 Left 2
SYMATTR InstName D1
SYMATTR Value UMZ27N
SYMBOL Cap 16 -48 R0
SYMATTR InstName C1
SYMATTR Value 100n
SYMBOL res -624 2496 R90
WINDOW 0 0 56 VBottom 2
WINDOW 3 32 56 VTop 2
SYMATTR InstName R4
SYMATTR Value 22k
SYMBOL diode -656 2304 R90
WINDOW 0 0 32 VBottom 2
WINDOW 3 32 32 VTop 2
SYMATTR InstName D2
SYMATTR Value 1N4148
SYMBOL Res -32 2352 R0
SYMATTR InstName R5
SYMATTR Value 22k
SYMBOL Cap -32 2544 R0
SYMATTR InstName C2
SYMATTR Value 470n
SYMBOL diode 256 2656 R0
SYMATTR InstName D3
SYMATTR Value 1N4148
SYMBOL npn 208 2432 R0
SYMATTR InstName Q1
SYMATTR Value BC546B
SYMBOL Res 256 2288 R0
SYMATTR InstName R6
SYMATTR Value 220
SYMBOL Res 288 2272 R180
WINDOW 0 36 76 Left 2
WINDOW 3 36 40 Left 2
SYMATTR InstName R7
SYMATTR Value 1.5k
SYMBOL Res 144 2464 R90
WINDOW 0 0 56 VBottom 2
WINDOW 3 32 56 VTop 2
SYMATTR InstName R8
SYMATTR Value 0
SYMBOL diode 1568 2256 R90
WINDOW 0 0 32 VBottom 2
WINDOW 3 32 32 VTop 2
SYMATTR InstName D4
SYMATTR Value 1N4148
SYMBOL npn 816 2928 M0
SYMATTR InstName Q2
SYMATTR Value BC546B
SYMBOL Res 736 2768 R0
SYMATTR InstName R9
SYMATTR Value 1.5k
SYMBOL Res 736 3040 R0
SYMATTR InstName R10
SYMATTR Value 0
SYMBOL Res 880 3040 R0
SYMATTR InstName R11
SYMATTR Value 3.3k
SYMBOL Res 1040 2960 R90
WINDOW 0 0 56 VBottom 2
WINDOW 3 32 56 VTop 2
SYMATTR InstName R13
SYMATTR Value 220
SYMBOL Res 752 2880 R90
WINDOW 0 0 56 VBottom 2
WINDOW 3 32 56 VTop 2
SYMATTR InstName R12
SYMATTR Value 510
SYMBOL npn 688 2000 M0
SYMATTR InstName Q3
SYMATTR Value BC546B
SYMBOL Res 752 2080 R0
SYMATTR InstName R16
SYMATTR Value 1.5k
SYMBOL Res 912 2032 R90
WINDOW 0 0 56 VBottom 2
WINDOW 3 32 56 VTop 2
SYMATTR InstName R17
SYMATTR Value 2.73k
SYMBOL Res 192 2064 R90
WINDOW 0 0 56 VBottom 2
WINDOW 3 32 56 VTop 2
SYMATTR InstName R14
SYMATTR Value 510
SYMBOL voltage 1344 3120 R0
WINDOW 3 24 96 Left 0
SYMATTR Value pulse(0 12 1 0.1 0.1 5 20 100)
SYMATTR InstName InjDrive
SYMBOL voltage 1328 2064 R0
WINDOW 3 24 96 Left 0
SYMATTR Value pulse(0 5 1 0.1 0.1 5 20 100)
SYMATTR InstName Tach
SYMBOL Res -784 2864 R0
SYMATTR InstName R15
SYMATTR Value 1.4k
SYMBOL npn 2432 -2416 M0
SYMATTR InstName Q4
SYMBOL npn 2608 -2464 M0
SYMATTR InstName Q5
SYMBOL diode 2272 -2336 R180
WINDOW 0 24 64 Left 2
WINDOW 3 24 0 Left 2
SYMATTR InstName D5
SYMBOL Res 2384 -2256 R90
WINDOW 0 0 56 VBottom 2
WINDOW 3 32 56 VTop 2
SYMATTR InstName R18
SYMATTR Value 120
SYMBOL Res 2464 -2224 R270
WINDOW 0 32 56 VTop 2
WINDOW 3 0 56 VBottom 2
SYMATTR InstName R19
SYMATTR Value 8k
SYMBOL npn -1920 -816 M0
SYMATTR InstName Q6
SYMBOL npn -1744 -864 M0
SYMATTR InstName Q7
SYMBOL diode -2080 -736 R180
WINDOW 0 24 64 Left 2
WINDOW 3 24 0 Left 2
SYMATTR InstName D6
SYMBOL Res -1968 -656 R90
WINDOW 0 0 56 VBottom 2
WINDOW 3 32 56 VTop 2
SYMATTR InstName R20
SYMATTR Value 120
SYMBOL Res -1888 -624 R270
WINDOW 0 32 56 VTop 2
WINDOW 3 0 56 VBottom 2
SYMATTR InstName R21
SYMATTR Value 8k
SYMBOL Res -1680 -768 R0
SYMATTR InstName R22
SYMATTR Value 10k
SYMBOL npn -1920 -272 M0
SYMATTR InstName Q8
SYMBOL npn -1744 -320 M0
SYMATTR InstName Q9
SYMBOL diode -2080 -192 R180
WINDOW 0 24 64 Left 2
WINDOW 3 24 0 Left 2
SYMATTR InstName D7
SYMBOL Res -1968 -112 R90
WINDOW 0 0 56 VBottom 2
WINDOW 3 32 56 VTop 2
SYMATTR InstName R23
SYMATTR Value 120
SYMBOL Res -1888 -80 R270
WINDOW 0 32 56 VTop 2
WINDOW 3 0 56 VBottom 2
SYMATTR InstName R24
SYMATTR Value 8k
SYMBOL Res -1680 -224 R0
SYMATTR InstName R25
SYMATTR Value 10k
SYMBOL Res -1488 -288 R90
WINDOW 0 0 56 VBottom 2
WINDOW 3 32 56 VTop 2
SYMATTR InstName R26
SYMATTR Value 470
SYMBOL diode -1712 -960 R270
WINDOW 0 32 32 VTop 2
WINDOW 3 0 32 VBottom 2
SYMATTR InstName D8
SYMATTR Value 1N4007
SYMBOL Res -1536 -768 R0
SYMATTR InstName R28
SYMATTR Value 2.2k
SYMBOL diode -1344 -672 R180
WINDOW 0 24 64 Left 2
WINDOW 3 24 0 Left 2
SYMATTR InstName D9
SYMATTR Value 1N4007
SYMBOL voltage -1200 -144 R0
WINDOW 3 24 96 Left 0
SYMATTR Value pulse(0 5 1 0.1 0.1 5 20 100)
SYMATTR InstName DigIdleClosed
SYMBOL Res -2320 -1232 R0
SYMATTR InstName R27
SYMATTR Value 100
SYMBOL Res -2320 -576 R0
SYMATTR InstName R29
SYMATTR Value 100
SYMBOL res -464 -1568 R90
WINDOW 0 0 56 VBottom 2
WINDOW 3 32 56 VTop 2
SYMATTR InstName R30
SYMATTR Value 1k
SYMBOL Res 176 -1760 R0
SYMATTR InstName R31
SYMATTR Value 4.7k
SYMBOL Cap -448 -1440 R0
SYMATTR InstName C4
SYMATTR Value 100n
SYMBOL Cap -320 -1440 R0
SYMATTR InstName C5
SYMATTR Value 10n
SYMBOL Res -224 -1456 R0
SYMATTR InstName R33
SYMATTR Value 22k
SYMBOL Res -224 -1312 R0
SYMATTR InstName R34
SYMATTR Value 1k
SYMBOL Res -224 -1152 R0
SYMATTR InstName R35
SYMATTR Value 36.3k
SYMBOL Res -64 -1152 R0
SYMATTR InstName R37
SYMATTR Value 1.96k
SYMBOL Res -16 -1328 R90
WINDOW 0 0 56 VBottom 2
WINDOW 3 32 56 VTop 2
SYMATTR InstName R38
SYMATTR Value 1000k
SYMBOL Res 208 -2800 R0
SYMATTR InstName R40
SYMATTR Value 4.7k
SYMBOL Cap -304 -2480 R0
SYMATTR InstName C6
SYMATTR Value 10n
SYMBOL Res -208 -2496 R0
SYMATTR InstName R42
SYMATTR Value 22k
SYMBOL Res -208 -2352 R0
SYMATTR InstName R43
SYMATTR Value 1k
SYMBOL Res -208 -2192 R0
SYMATTR InstName R44
SYMATTR Value 27
SYMBOL Res 0 -2368 R90
WINDOW 0 0 56 VBottom 2
WINDOW 3 32 56 VTop 2
SYMATTR InstName R47
SYMATTR Value 1000k
SYMBOL Res -32 -2224 R90
WINDOW 0 0 56 VBottom 2
WINDOW 3 32 56 VTop 2
SYMATTR InstName R39
SYMATTR Value 5.11k
SYMBOL Res -256 -2064 R90
WINDOW 0 0 56 VBottom 2
WINDOW 3 32 56 VTop 2
SYMATTR InstName R45
SYMATTR Value 33k
SYMBOL Res -208 -2016 R0
SYMATTR InstName R46
SYMATTR Value 27
SYMBOL Res -208 -1888 R0
SYMATTR InstName R48
SYMATTR Value 680
SYMBOL voltage -592 -1200 R0
WINDOW 3 24 96 Left 0
SYMATTR Value PULSE(0 1 2 0.1 0.1 6 20 100)
SYMATTR InstName EngineO2Sensor
SYMBOL npn 1088 160 M90
SYMATTR InstName Q10
SYMBOL npn 1424 160 R90
SYMATTR InstName Q11
SYMBOL Res 1232 304 R0
SYMATTR InstName R32
SYMATTR Value 287
SYMBOL Res 1120 -128 R0
SYMATTR InstName R36
SYMATTR Value 5.62k
SYMBOL Res 1360 -128 R0
SYMATTR InstName R41
SYMATTR Value 5.62k
SYMBOL Res 1616 96 R0
SYMATTR InstName R49
SYMATTR Value 1k
SYMBOL Res 1856 176 R0
SYMATTR InstName R50
SYMATTR Value 3.83k
SYMBOL Res 2048 176 R0
SYMATTR InstName R51
SYMATTR Value 121k
SYMBOL Res 2224 176 R0
SYMATTR InstName R52
SYMATTR Value 14.7k
SYMBOL npn 2080 1200 R0
SYMATTR InstName Q12
SYMBOL npn 1904 1152 R0
SYMATTR InstName Q13
SYMBOL diode 2240 1280 M180
WINDOW 0 24 64 Left 2
WINDOW 3 24 0 Left 2
SYMATTR InstName D10
SYMBOL Res 2128 1360 M90
WINDOW 0 0 56 VBottom 2
WINDOW 3 32 56 VTop 2
SYMATTR InstName R53
SYMATTR Value 120
SYMBOL Res 2048 1392 M270
WINDOW 0 32 56 VTop 2
WINDOW 3 0 56 VBottom 2
SYMATTR InstName R54
SYMATTR Value 8k
SYMBOL Res 1984 1536 R0
SYMATTR InstName R55
SYMATTR Value 1
SYMBOL Res 2080 1536 R0
SYMATTR InstName R56
SYMATTR Value 18
SYMBOL Res 1744 1360 R0
SYMATTR InstName R57
SYMATTR Value 100
SYMBOL Res 1680 1472 R90
WINDOW 0 0 56 VBottom 2
WINDOW 3 32 56 VTop 2
SYMATTR InstName R59
SYMATTR Value 2.2k
SYMBOL Res 1680 1184 R90
WINDOW 0 0 56 VBottom 2
WINDOW 3 32 56 VTop 2
SYMATTR InstName R58
SYMATTR Value 15
SYMBOL Cap 2208 1552 R0
SYMATTR InstName C3
SYMATTR Value 10n
SYMBOL diode 2496 1616 R180
WINDOW 0 24 64 Left 2
WINDOW 3 24 0 Left 2
SYMATTR InstName D12
SYMATTR Value 1N4007
SYMBOL Cap 2544 1552 R0
SYMATTR InstName C7
SYMATTR Value 10n
SYMBOL Res 2544 816 R0
SYMATTR InstName R61
SYMATTR Value 1.8k
SYMBOL Res 2656 816 R0
SYMATTR InstName R62
SYMATTR Value 5.62k
SYMBOL Res 2736 816 R0
SYMATTR InstName R64
SYMATTR Value 8.25k
SYMBOL Cap 2432 832 R0
SYMATTR InstName C9
SYMATTR Value 330p
SYMBOL diode 1776 896 R180
WINDOW 0 24 64 Left 2
WINDOW 3 24 0 Left 2
SYMATTR InstName D13
SYMATTR Value 1N4148
SYMBOL diode 1776 1072 R180
WINDOW 0 24 64 Left 2
WINDOW 3 24 0 Left 2
SYMATTR InstName D14
SYMATTR Value 1N4148
SYMBOL pnp 1168 1312 R0
SYMATTR InstName Q14
SYMBOL npn 1008 1296 M180
SYMATTR InstName Q15
SYMATTR Value BC546B
SYMBOL diode 1344 1472 R90
WINDOW 0 0 32 VBottom 2
WINDOW 3 32 32 VTop 2
SYMATTR InstName D15
SYMATTR Value 1N4148
SYMBOL Res 1056 1376 R0
SYMATTR InstName R65
SYMATTR Value 150
SYMBOL Comparators/LT1017 -128 -2576 R0
SYMATTR InstName U6
SYMBOL npn 32 -2624 R0
SYMATTR InstName Q16
SYMBOL npn 0 -1584 R0
SYMATTR InstName Q17
SYMBOL Comparators/LT1017 -144 -1536 R0
SYMATTR InstName U3
SYMBOL Comparators/LT1017 480 224 R0
SYMATTR InstName U5
SYMBOL npn 576 176 R0
SYMATTR InstName Q19
SYMBOL Comparators/LT1017 -512 2528 R0
SYMATTR InstName U2
SYMBOL npn -416 2480 R0
SYMATTR InstName Q20
SYMBOL Res 3376 624 R0
SYMATTR InstName R63
SYMATTR Value 39k
SYMBOL Res 3536 624 R0
SYMATTR InstName R66
SYMATTR Value 3.61k
SYMBOL npn 2224 2928 M0
SYMATTR InstName Q18
SYMATTR Value BC546B
SYMBOL Res 2144 2768 R0
SYMATTR InstName R60
SYMATTR Value 1.5k
SYMBOL Res 2288 3040 R0
SYMATTR InstName R68
SYMATTR Value 2.2k
SYMBOL Res 2448 2960 R90
WINDOW 0 0 56 VBottom 2
WINDOW 3 32 56 VTop 2
SYMATTR InstName R69
SYMATTR Value 2.2k
SYMBOL Res 2080 2880 R90
WINDOW 0 0 56 VBottom 2
WINDOW 3 32 56 VTop 2
SYMATTR InstName R70
SYMATTR Value 510
SYMBOL voltage 2752 3120 R0
WINDOW 3 24 96 Left 0
SYMATTR Value pulse(0 12 1 0.1 0.1 5 20 100)
SYMATTR InstName TestSocket
SYMBOL Res -1616 2208 R90
WINDOW 0 0 56 VBottom 2
WINDOW 3 32 56 VTop 2
SYMATTR InstName R67
SYMATTR Value 22k
SYMBOL Res -1776 2288 R0
SYMATTR InstName R71
SYMATTR Value 10k
SYMBOL Res -1920 2128 R90
WINDOW 0 0 56 VBottom 2
WINDOW 3 32 56 VTop 2
SYMATTR InstName R72
SYMATTR Value 470
SYMBOL Cap -2128 2224 R0
SYMATTR InstName C8
SYMATTR Value 470p
SYMBOL npn -1792 2176 M0
SYMATTR InstName Q21
SYMATTR Value BC546B
SYMBOL Res -2416 2160 R0
SYMATTR InstName R73
SYMATTR Value 4.7k
SYMBOL Cap -2416 2320 R0
SYMATTR InstName C10
SYMATTR Value 100n
SYMBOL Res -2080 1872 R0
SYMATTR InstName R74
SYMATTR Value 46.4k
SYMBOL Res -1936 1872 R0
SYMATTR InstName R76
SYMATTR Value 1.78k
SYMBOL Res -2112 1808 R90
WINDOW 0 0 56 VBottom 2
WINDOW 3 32 56 VTop 2
SYMATTR InstName R77
SYMATTR Value 2.2k
SYMBOL Res -2640 2160 R0
SYMATTR InstName R79
SYMATTR Value 150
SYMBOL zener -2608 2368 R180
WINDOW 0 24 64 Left 2
WINDOW 3 24 0 Left 2
SYMATTR InstName D11
SYMATTR Value 1N750
SYMBOL Res -2832 1424 R90
WINDOW 0 0 56 VBottom 2
WINDOW 3 32 56 VTop 2
SYMATTR InstName R78
SYMATTR Value 15
SYMBOL npn -2432 2992 M0
SYMATTR InstName Q22
SYMBOL Res -3184 2944 R90
WINDOW 0 0 56 VBottom 2
WINDOW 3 32 56 VTop 2
SYMATTR InstName R80
SYMATTR Value 432
SYMBOL Res -3392 2832 R0
SYMATTR InstName R81
SYMATTR Value 2.2k
SYMBOL npn -2992 2560 M0
SYMATTR InstName Q23
SYMBOL npn -2816 2512 M0
SYMATTR InstName Q24
SYMBOL diode -3152 2640 R180
WINDOW 0 24 64 Left 2
WINDOW 3 24 0 Left 2
SYMATTR InstName D16
SYMBOL Res -3040 2720 R90
WINDOW 0 0 56 VBottom 2
WINDOW 3 32 56 VTop 2
SYMATTR InstName R82
SYMATTR Value 120
SYMBOL Res -2960 2752 R270
WINDOW 0 32 56 VTop 2
WINDOW 3 0 56 VBottom 2
SYMATTR InstName R83
SYMATTR Value 8k
SYMBOL Res -3520 1856 R90
WINDOW 0 0 56 VBottom 2
WINDOW 3 32 56 VTop 2
SYMATTR InstName R84
SYMATTR Value 0
SYMBOL Cap -3056 1552 R0
SYMATTR InstName C11
SYMATTR Value 22µ
SYMBOL Res -3168 1520 R0
SYMATTR InstName R85
SYMATTR Value 1k
SYMBOL zener -2928 2416 R90
WINDOW 0 -4 32 VBottom 2
WINDOW 3 36 32 VTop 2
SYMATTR InstName D17
SYMATTR Value UDZV47
SYMBOL Res -3424 2416 R90
WINDOW 0 0 56 VBottom 2
WINDOW 3 32 56 VTop 2
SYMATTR InstName R86
SYMATTR Value 810
SYMBOL Cap -3296 1552 R0
SYMATTR InstName C12
SYMATTR Value 100p
SYMBOL pnp -3568 2928 R270
SYMATTR InstName Q25
SYMBOL npn -3680 2784 M270
SYMATTR InstName Q26
SYMBOL diode -3392 2560 R0
SYMATTR InstName D18
SYMATTR Value VS-E5PX7506
SYMBOL Res -2528 1168 R90
WINDOW 0 0 56 VBottom 2
WINDOW 3 32 56 VTop 2
SYMATTR InstName R89
SYMATTR Value 1k
SYMBOL Res -2528 1072 R90
WINDOW 0 0 56 VBottom 2
WINDOW 3 32 56 VTop 2
SYMATTR InstName R88
SYMATTR Value 1k
SYMBOL Cap -2384 1136 R0
SYMATTR InstName C13
SYMATTR Value 680p
SYMBOL Res -4224 -384 R0
SYMATTR InstName R87
SYMATTR Value 47k
SYMBOL Res -3968 -384 R0
SYMATTR InstName R90
SYMATTR Value 15.3k
SYMBOL Diode -4048 -256 R90
WINDOW 0 0 32 VBottom 2
WINDOW 3 32 32 VTop 2
SYMATTR InstName D19
SYMBOL Res -4224 -32 R0
SYMATTR InstName R91
SYMATTR Value 47k
SYMBOL Res -3968 -32 R0
SYMATTR InstName R92
SYMATTR Value 15.3k
SYMBOL Diode -4048 96 R90
WINDOW 0 0 32 VBottom 2
WINDOW 3 32 32 VTop 2
SYMATTR InstName D20
SYMBOL Res -4016 -768 R90
WINDOW 0 0 56 VBottom 2
WINDOW 3 32 56 VTop 2
SYMATTR InstName R93
SYMATTR Value 33k
SYMBOL Res -4112 -976 R90
WINDOW 0 0 56 VBottom 2
WINDOW 3 32 56 VTop 2
SYMATTR InstName R94
SYMATTR Value 33k
SYMBOL Res -3968 -1088 R90
WINDOW 0 0 56 VBottom 2
WINDOW 3 32 56 VTop 2
SYMATTR InstName R96
SYMATTR Value 2.2k
SYMBOL Cap -2144 -2544 R0
SYMATTR InstName C14
SYMATTR Value 100µ
SYMBOL npn -2240 -3280 M0
SYMATTR InstName Q27
SYMBOL npn -2064 -3328 M0
SYMATTR InstName Q28
SYMBOL diode -2400 -3200 R180
WINDOW 0 24 64 Left 2
WINDOW 3 24 0 Left 2
SYMATTR InstName D21
SYMBOL Res -2288 -3120 R90
WINDOW 0 0 56 VBottom 2
WINDOW 3 32 56 VTop 2
SYMATTR InstName R95
SYMATTR Value 120
SYMBOL Res -2208 -3088 R270
WINDOW 0 32 56 VTop 2
WINDOW 3 0 56 VBottom 2
SYMATTR InstName R97
SYMATTR Value 8k
SYMBOL Res -2432 -3072 R0
SYMATTR InstName R98
SYMATTR Value 5.6
SYMBOL diode -1568 -3152 R180
WINDOW 0 24 64 Left 2
WINDOW 3 24 0 Left 2
SYMATTR InstName D22
SYMATTR Value 1N4148
SYMBOL Diode -1472 -3296 R90
WINDOW 0 0 32 VBottom 2
WINDOW 3 32 32 VTop 2
SYMATTR InstName D23
SYMATTR Value 1N4148
SYMBOL Res -1600 -3120 R0
SYMATTR InstName R111
SYMATTR Value 3.3k
SYMBOL Cap -1744 -3216 R0
SYMATTR InstName C15
SYMATTR Value 100n
SYMBOL zener -1840 -3152 R180
WINDOW 0 24 64 Left 2
WINDOW 3 24 0 Left 2
SYMATTR InstName D24
SYMATTR Value 1N750
SYMBOL zener -1840 -3328 R180
WINDOW 0 24 64 Left 2
WINDOW 3 24 0 Left 2
SYMATTR InstName D25
SYMATTR Value UDZV47
SYMBOL Res -3936 -1664 R90
WINDOW 0 0 56 VBottom 2
WINDOW 3 32 56 VTop 2
SYMATTR InstName R99
SYMATTR Value 55.2k
SYMBOL Res -3952 -1760 R90
WINDOW 0 0 56 VBottom 2
WINDOW 3 32 56 VTop 2
SYMATTR InstName R100
SYMATTR Value 55.2k
SYMBOL Res -4016 -672 R90
WINDOW 0 0 56 VBottom 2
WINDOW 3 32 56 VTop 2
SYMATTR InstName R101
SYMATTR Value 33k
SYMBOL Res -3984 -2064 R90
WINDOW 0 0 56 VBottom 2
WINDOW 3 32 56 VTop 2
SYMATTR InstName R102
SYMATTR Value 100k
SYMBOL voltage -1936 -2576 R0
SYMATTR InstName VCC2
SYMATTR Value 12
SYMBOL diode -3760 2608 R270
WINDOW 0 32 32 VTop 2
WINDOW 3 0 32 VBottom 2
SYMATTR InstName D26
SYMATTR Value 1N4007
SYMBOL Res -3808 2848 R90
WINDOW 0 0 56 VBottom 2
WINDOW 3 32 56 VTop 2
SYMATTR InstName R75
TEXT -2696 488 Left 0 !.tran 500000m
TEXT -2696 520 Left 0 !.plot tran V(IN) V(OUT_CH)
TEXT -672 2928 Left 2 ;AFM REsisteance to damp oscillations
TEXT -2560 -1168 Left 2 ;Simulated ICV Load
TEXT -2696 464 Left 2 ;.dc VCC1 0 12
TEXT 784 1792 Left 6 ;TIMING DELAY FROM KLR
TEXT 624 3280 Left 6 ;KL_Trigger_Drive
TEXT 800 2264 Left 7 ;Tach_Drive
TEXT -592 3000 Left 6 ;Engine Air Flow 3
TEXT -2456 128 Left 7 ;Idle Control Valve
TEXT -416 -912 Left 6 ;O2 Sensor Recovery
TEXT 2032 3280 Left 6 ;Test Socket
TEXT -2608 1648 Left 6 ;S400\nInj Driver
TEXT -3176 3304 Left 7 ;Injector Driver
TEXT -2744 -2880 Left 6 ;Engine Start Signal From DME Relay
TEXT -2504 -2344 Left 6 ;12V From DME Relay
TEXT -2256 -1848 Left 6 ;Grounds
TEXT -4248 264 Left 6 ;Passthroughs\nto Digital
TEXT -2000 -3072 Left 2 ;Should be 2.7V\nnot 4.7
RECTANGLE Normal -760 -472 3136 1888
RECTANGLE Normal 364 2748 1552 3348
RECTANGLE Normal -116 1920 1420 2320
RECTANGLE Normal -1080 2272 336 3076
RECTANGLE Normal -968 244 -2812 -1460
RECTANGLE Normal -976 -2956 1000 -808
RECTANGLE Normal 1620 2748 3000 3344
RECTANGLE Normal -2780 1616 -2128 1768
RECTANGLE Normal -4172 772 -1228 3600
RECTANGLE Normal -3012 -3512 -1104 -2820
RECTANGLE Normal -2580 -2652 -1604 -2288
RECTANGLE Normal -2572 -2228 -1596 -1792
RECTANGLE Normal -4580 -2596 -3360 448

The netlist it stands for:
* dme_analog_full_flat.asc
V§TD_Input_KR TD_INPUT_KR 0 pulse(0 5 1 0.1 0.1 50 100)
R501 12VRAIL TD_INPUT_KR 10k
R502 N026 N031 1k
C501 N031 TD_INPUT_KR 470n
D501 N026 12VRAIL 1N4148
R513 N025 12VRAIL 22k
R512 N025 N029 220k
R511 N029 0 13.1k
D502 OUT_CH N025 1N4148
R506 VCC OUT_CH 1k
VCC VCC 0 5
R1 12VRAIL N029 100k
R2 12VRAIL N026 330k
VCC1 Eng12V 0 12
R3 Eng12V 12VRAIL 220
D1 0 12VRAIL UMZ27N
C1 12VRAIL 0 100n
R4 N060 EngAirFlow3Out_P9 22k
D2 N060 VCC 1N4148
R5 12VRAIL N064 22k
C2 N064 0 470n
D3 N069 EngAirFlow3Out_P9 1N4148
Q1 N063 N065 N069 0 BC546B
R6 N059 N063 220
R7 N059 N051 1.5k
R8 N065 N064 0
D4 Eng12V N059 1N4148
Q2 N071 N076 N079 0 BC546B
R9 N059 N071 1.5k
R10 N079 0 0
R11 N076 0 3.3k
R13 DIG_inj_drive_V1.8 N076 220
R12 N071 KR_Trigger_P31 510
Q3 N051 N052 0 0 BC546B
R16 N052 0 1.5k
R17 tach_adv22 N052 2.73k
R14 N051 N053 510
V§InjDrive DIG_inj_drive_V1.8 0 pulse(0 12 1 0.1 0.1 5 20 100)
V§Tach tach_adv22 0 pulse(0 5 1 0.1 0.1 5 20 100)
R15 EngAirFlow3Out_P9 0 1.4k
Q4 N008 N010 0 0 NPN
Q5 N008 N009 N010 0 NPN
D5 0 N008 D
R18 N010 0 120
R19 N010 N009 8k
Q6 EngineIdleOpen N020 0 0 NPN
Q7 EngineIdleOpen N019 N020 0 NPN
D6 0 EngineIdleOpen D
R20 N020 0 120
R21 N020 N019 8k
R22 N019 0 10k
Q8 EngineIdleClosed N022 0 0 NPN
Q9 EngineIdleClosed N021 N022 0 NPN
D7 0 EngineIdleClosed D
R23 N022 0 120
R24 N022 N021 8k
R25 N021 0 10k
R26 DigIdleClosed N021 470
D8 EngineIdleOpen EngPwrRelay12VG587_P18 1N4007
R28 N019 EngineIdleClosed 2.2k
D9 EngineIdleClosed EngPwrRelay12VG587_P18 1N4007
V§DigIdleClosed DigIdleClosed 0 pulse(0 5 1 0.1 0.1 5 20 100)
R27 Eng12V EngineIdleOpen 100
R29 Eng12V EngineIdleClosed 100
R30 N005 EngineO2Sensor_P24 1k
R31 VCC DigO2Bottom_V1.14 4.7k
C4 N005 0 100n
C5 N016 0 10n
R33 N016 N017 22k
R34 N017 N014 1k
R35 N014 0 36.3k
R37 N014 0 1.96k
R38 DigO2Bottom_V1.14 N017 1000k
R40 VCC DigO2Top_V1.12 4.7k
C6 N007 0 10n
R42 N007 N011 22k
R43 N011 N012 1k
R44 N012 N013 27
R47 DigO2Top_V1.12 N011 1000k
R39 VCC N012 5.11k
R45 N013 N005 33k
R46 N013 N014 27
R48 N014 0 680
V§EngineO2Sensor EngineO2Sensor_P24 0 PULSE(0 1 2 0.1 0.1 6 20 100)
Q10 OUT_CH N024 N030 0 NPN
Q11 N028 N023 N030 0 NPN
R32 N030 0 287
R36 VCC N024 5.62k
R41 VCC N023 5.62k
R49 VCC N028 1k
R50 N023 0 3.83k
R51 N023 0 121k
R52 N023 0 14.7k
Q12 EngineIgnCoil_P1 N041 N042 0 NPN
Q13 EngineIgnCoil_P1 N039 N041 0 NPN
D10 N042 EngineIgnCoil_P1 D
R53 N041 N042 120
R54 N041 N039 8k
R55 N041 0 1
R56 N041 0 18
R57 N039 N041 100
R59 N041 N024 2.2k
R58 N039 N038 15
C3 N041 0 10n
D12 0 EngineIgnCoil_P1 1N4007
C7 EngineIgnCoil_P1 0 10n
R61 N033 EngineIgnCoil_P1 1.8k
R62 N033 0 5.62k
R64 N033 0 8.25k
C9 N033 EngineIgnCoil_P1 330p
D13 N034 N033 1N4148
D14 N039 N034 1N4148
Q14 N038 N043 N045 0 PNP
Q15 N043 OUT_CH N038 0 BC546B
D15 Eng12V N045 1N4148
R65 N043 N045 150
XU6 N007 N005 Eng12V 0 N006 LT1017  ; pins In+ In- V+ V- OUT
Q16 DigO2Top_V1.12 N006 0 0 NPN
Q17 DigO2Bottom_V1.14 N015 0 0 NPN
XU3 N016 N005 Eng12V 0 N015 LT1017  ; pins In+ In- V+ V- OUT
XU5 N029 N026 Eng12V 0 N027 LT1017  ; pins In+ In- V+ V- OUT
Q19 N025 N027 0 0 NPN
XU2 VCC N060 Eng12V 0 N066 LT1017  ; pins In+ In- V+ V- OUT
Q20 N064 N066 0 0 NPN
R63 Eng12V Dig12VRef_V1.16 39k
R66 Eng12V Dig12VRef_V1.16 3.61k
Q18 N073 N077 0 0 BC546B
R60 N059 N073 1.5k
R68 N077 0 2.2k
R69 DIG_inj_drive_V1.15 N077 2.2k
R70 N073 N072 510
V§TestSocket DIG_inj_drive_V1.15 0 pulse(0 12 1 0.1 0.1 5 20 100)
R67 N058 N057 22k
R71 N057 0 10k
R72 N055 N054 470
C8 N054 0 470p
Q21 N055 N057 0 0 BC546B
R73 N054 N044 4.7k
C10 N044 0 100n
R74 N048 0 46.4k
R76 N048 0 1.78k
R77 N048 N047 2.2k
R79 N056 N044 150
D11 0 N044 1N750
R78 N044 EngPwrRelay12VG587_P18 15
Q22 N075 N078 0 0 NPN
R80 N075 N074 432
R81 N067 N074 2.2k
Q23 N035 N068 0 0 NPN
Q24 N035 N062 N068 0 NPN
D16 0 N035 D
R82 N068 0 120
R83 N068 N062 8k
R84 N050 N049 0
C11 N046 0 22µ
R85 N040 N035 1k
D17 N062 N035 UDZV47
R86 N035 N061 810
C12 N040 0 100p
Q25 N070 N074 N067 0 PNP
Q26 N067 N070 EngPwrRelay12VG587_P18 0 NPN
D18 N035 N067 VS-E5PX7506
R89 N037 N035 1k
R88 N036 N035 1k
C13 N036 N040 680p
R87 VCC KLR_Full_Load_P3 47k
R90 VCC DigThrottleIdle_V1.24 15.3k
D19 DigThrottleIdle_V1.24 KLR_Full_Load_P3 D
R91 VCC EngThrottleIdle_P2 47k
R92 VCC DigThrottleIdle_V1.23 15.3k
D20 DigThrottleIdle_V1.23 EngThrottleIdle_P2 D
R93 DigSpeedSensor_V1.2 EngSpeedSensor_P8 33k
R94 DigPerfData_V1.19 EngPerfData_P10 33k
R96 VCC DigPerfData_V1.19 2.2k
C14 EngPwrRelay12VG587_P18 0 100µ
Q27 EngPwrRelayG5_85b_P20 N002 N003 0 NPN
Q28 EngPwrRelayG5_85b_P20 N001 N002 0 NPN
D21 N003 EngPwrRelayG5_85b_P20 D
R95 N002 N003 120
R97 N002 N001 8k
R98 N003 0 5.6
D22 N004 N001 1N4148
D23 DigStart_V1.7 N001 1N4148
R111 N004 EngStartSignalP4 3.3k
C15 N001 0 100n
D24 0 N001 1N750
D25 N001 EngPwrRelayG5_85b_P20 UDZV47
R99 DigRefMarkSensor_V1.3 EngRefMarkSensorIn_P25 55.2k
R100 DigRefMarkSensor_V1.4 EngRefMarkSensorOut_P26 55.2k
R101 DigSpeedSensor_V1.1 EngSpeedSensorIn_P27 33k
R102 DigACCompressor_V1.18 EngACCompressorIn_P29 100k
VCC2 EngPwrRelay12VG587_P18 0 12
D26 EngPwrRelay12VG587_P18 N067 1N4007
R75 N070 EngPwrRelay12VG587_P18 R
.model D D
.lib standard.dio
.model NPN NPN
.model PNP PNP
.lib standard.bjt
.tran 500000m
.plot tran V(IN) V(OUT_CH)
* AFM REsisteance to damp oscillations
* Simulated ICV Load
* .dc VCC1 0 12
* TIMING DELAY FROM KLR
* KL_Trigger_Drive
* Tach_Drive
* Engine Air Flow 3
* Idle Control Valve
* O2 Sensor Recovery
* Test Socket
* S400
* Inj Driver
* Injector Driver
* Engine Start Signal From DME Relay
* 12V From DME Relay
* Grounds
* Passthroughs
* to Digital
* Should be 2.7V
* not 4.7
.backanno
.end